# Altium project SmartWatch.PrjPcb
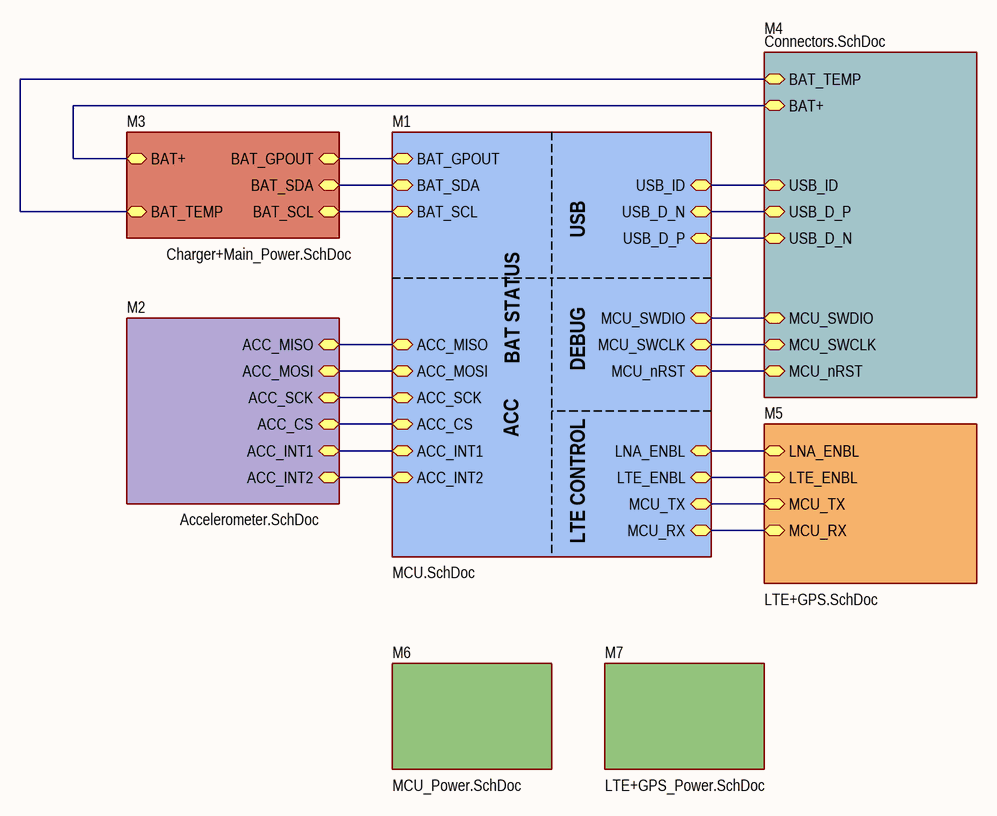
[diagram p0: Top_level.SchDoc]
8 sheets, 111 parts. Net scope: hierarchical (ports join the sheet entries above them; power ports are global).
Sheets:
  Top_level.SchDoc
    M1 = MCU.SchDoc
    M2 = Accelerometer.SchDoc
    M3 = Charger+Main_Power.SchDoc
    M4 = Connectors.SchDoc
    M5 = LTE+GPS.SchDoc
    M6 = MCU_Power.SchDoc
    M7 = LTE+GPS_Power.SchDoc

## Sheet Top_level.SchDoc
size 420 x 297 mm

### Sub-sheets
M1 = MCU.SchDoc: BAT_GPOUT (bidir), BAT_SDA (bidir), BAT_SCL (bidir), ACC_INT2 (bidir), ACC_CS (bidir), LTE_ENBL (bidir), MCU_RX (bidir), ACC_MISO (bidir), ACC_MOSI (bidir), MCU_TX (bidir), MCU_nRST (bidir), MCU_SWCLK (bidir), MCU_SWDIO (bidir), USB_D_N (bidir), USB_D_P (bidir), ACC_INT1 (bidir), ACC_SCK (bidir), USB_ID (bidir), LNA_ENBL (bidir)
M2 = Accelerometer.SchDoc: ACC_MOSI (bidir), ACC_INT1 (bidir), ACC_CS (bidir), ACC_INT2 (bidir), ACC_SCK (bidir), ACC_MISO (bidir)
M3 = Charger+Main_Power.SchDoc: BAT_GPOUT (bidir), BAT_SDA (bidir), BAT_TEMP (bidir), BAT_SCL (bidir), BAT+ (bidir)
M4 = Connectors.SchDoc: BAT_TEMP (bidir), BAT+ (bidir), MCU_SWDIO (bidir), MCU_nRST (bidir), USB_D_P (bidir), USB_ID (bidir), MCU_SWCLK (bidir), USB_D_N (bidir)
M5 = LTE+GPS.SchDoc: LNA_ENBL (bidir), LTE_ENBL (bidir), MCU_RX (bidir), MCU_TX (bidir)
M6 = MCU_Power.SchDoc: no entries
M7 = LTE+GPS_Power.SchDoc: no entries

### Nets
BAT_TS: sheet M3/BAT_TEMP, sheet M4/BAT_TEMP
NetC8_2: sheet M3/BAT+, sheet M4/BAT+
NetC14_2: sheet M1/MCU_nRST, sheet M4/MCU_nRST
NetD3_A1: sheet M1/BAT_GPOUT, sheet M3/BAT_GPOUT
NetD3_A2: sheet M1/BAT_SDA, sheet M3/BAT_SDA
NetD3_A3: sheet M1/BAT_SCL, sheet M3/BAT_SCL
NetD5_1: sheet M1/USB_D_N, sheet M4/USB_D_P
NetD5_3: sheet M1/USB_D_P, sheet M4/USB_D_N
NetD8_C9: sheet M1/MCU_TX, sheet M5/MCU_TX
NetD8_D9: sheet M1/MCU_RX, sheet M5/MCU_RX
NetD8_E3: sheet M1/ACC_INT2, sheet M2/ACC_INT2
NetD8_F3: sheet M1/ACC_SCK, sheet M2/ACC_SCK
NetD8_G2: sheet M1/ACC_INT1, sheet M2/ACC_INT1
NetD8_G3: sheet M1/ACC_MOSI, sheet M2/ACC_MOSI
NetD8_H1: sheet M1/ACC_CS, sheet M2/ACC_CS
NetD8_H2: sheet M1/MCU_SWCLK, sheet M4/MCU_SWCLK
NetD8_H4: sheet M1/LNA_ENBL, sheet M5/LNA_ENBL
NetD8_J1: sheet M1/ACC_MISO, sheet M2/ACC_MISO
NetD8_J2: sheet M1/MCU_SWDIO, sheet M4/MCU_SWDIO
NetD8_J3: sheet M1/USB_ID, sheet M4/USB_ID
NetD8_K2: sheet M1/LTE_ENBL, sheet M5/LTE_ENBL

### Notes on the sheet
- USB
- BAT STATUS
- DEBUG
- ACC
- LTE CONTROL
- Author
- Manufacturer
- Date
- Page
- Total pages
- Size page
- A3
- Materials

## Sheet MCU.SchDoc
size 420 x 297 mm
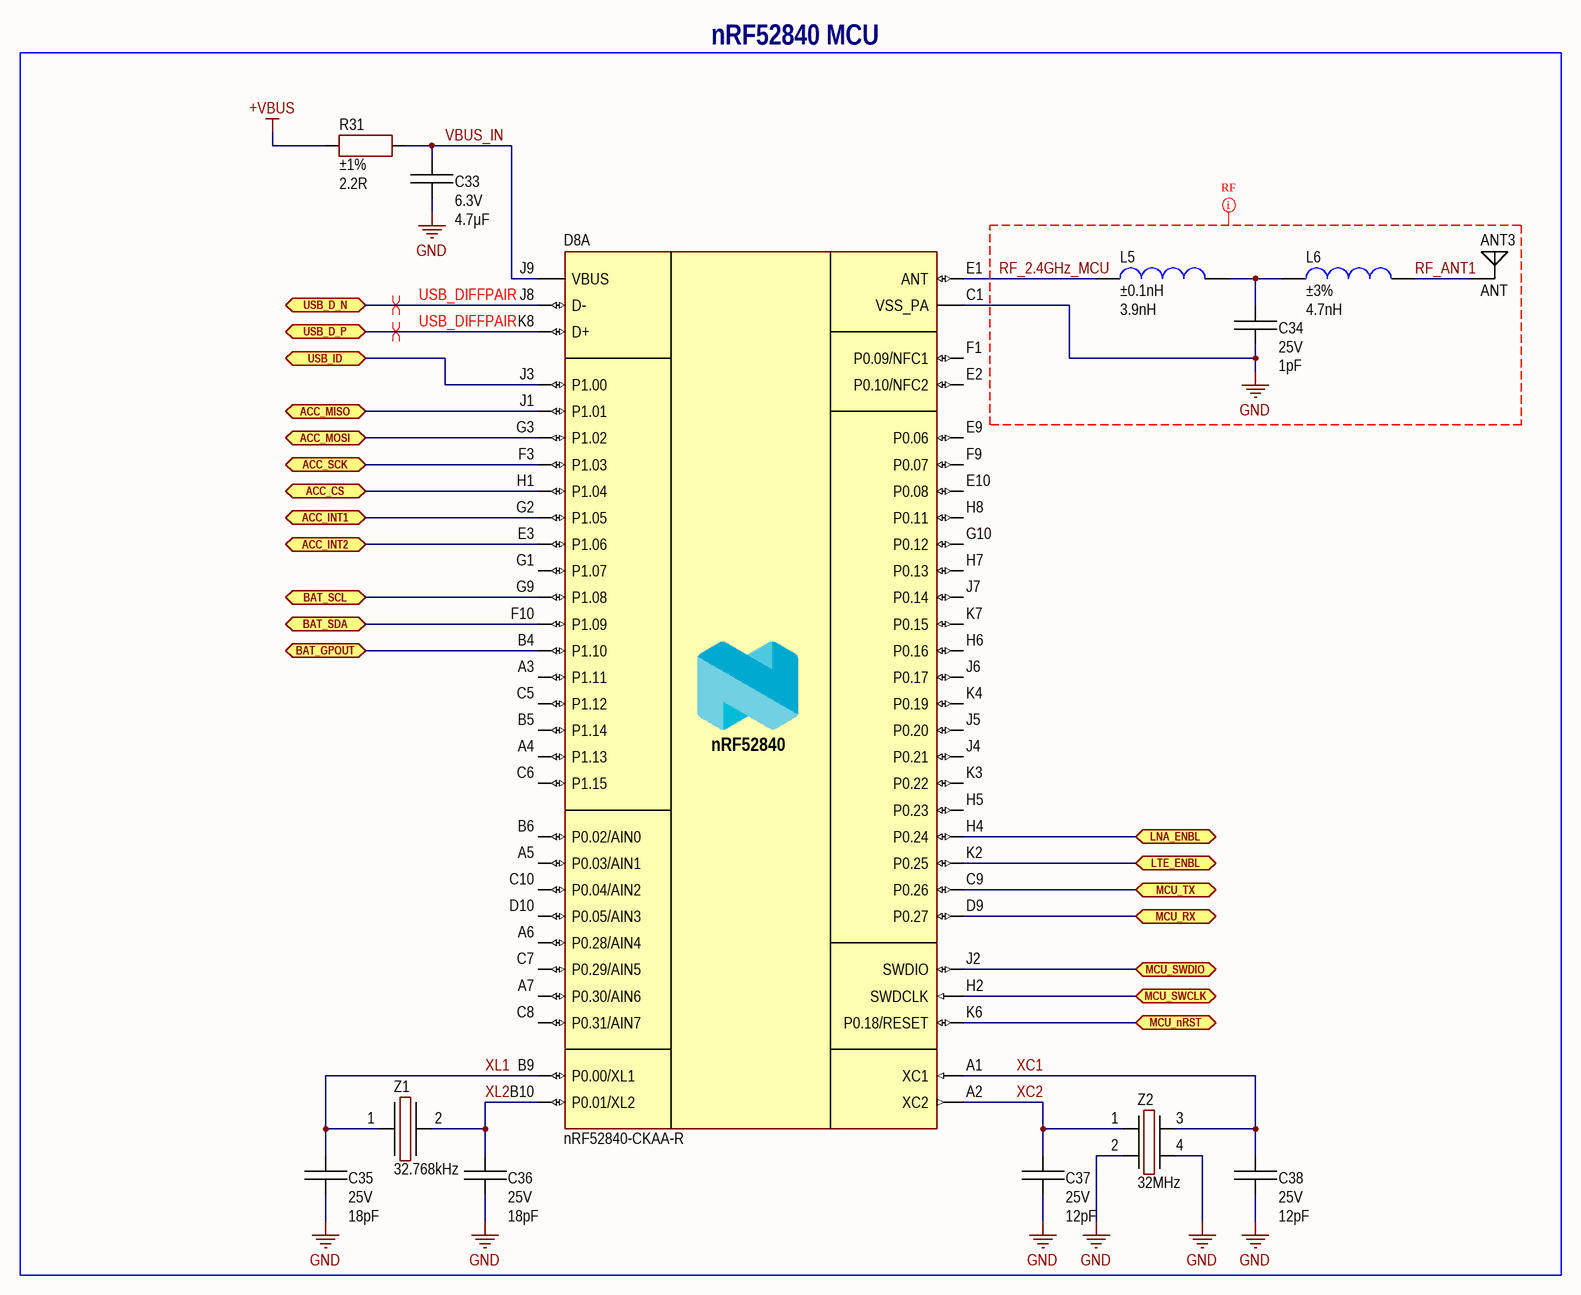
[diagram p1: MCU.SchDoc]

### Parts
ANT3  CommentText: ANT  [ANT: ANT2012LL00R2400A]
C33  value 4.7μF  Voltage: 6.3V  [CAP: 0603_NO_SILK]
C34  value 1pF  Voltage: 25V  [CAP: 0201]
C35  value 18pF  Voltage: 25V  [CAP: 0201]
C36  value 18pF  Voltage: 25V  [CAP: 0201]
C37  value 12pF  Voltage: 25V  [CAP: 0201]
C38  value 12pF  Voltage: 25V  [CAP: 0201]
D8  PartNumber: nRF52840-CKAA-R  [MCU: nRF52840_WLCP93]  (part A of 2)
L5  value 3.9nH  Tolerance: ±0.1nH  [IND: 0201]
L6  value 4.7nH  Tolerance: ±3%  [IND: 0201]
R31  value 2.2R  Tolerance: ±1%  [RES: 0402]
Z1  Frequency: 32.768kHz  [OSC: 2012]
Z2  Frequency: 32MHz  [OSC: 2016]

### Blocks framed on the sheet
nRF52840 MCU: ANT3 C33-C38 D8 L5 L6 R31 Z1 Z2

### Ports
ACC_CS (bidir), ACC_INT1 (bidir), ACC_INT2 (bidir), ACC_MISO (bidir), ACC_MOSI (bidir), ACC_SCK (bidir), BAT_GPOUT (bidir), BAT_SCL (bidir), BAT_SDA (bidir), LNA_ENBL (bidir), LTE_ENBL (bidir), MCU_nRST (bidir), MCU_RX (bidir), MCU_SWCLK (bidir), MCU_SWDIO (bidir), MCU_TX (bidir), USB_D_N (bidir), USB_D_P (bidir), USB_ID (bidir)

### Nets
+VBUS: R31.1
GND: C33.1 C34.1 C35.1 C36.1 C37.1 C38.1 D8.C1(VSS_PA) Z2.2 Z2.4
RF_2.4GHz_MCU: D8.E1(ANT) L5.2
RF_ANT1: ANT3.1 L6.1
VBUS_IN: C33.2 D8.J9(VBUS) R31.2
XC1: C38.2 D8.A1(XC1) Z2.3
XC2: C37.2 D8.A2(XC2) Z2.1
XL1: C35.2 D8.B9(P0.00/XL1) Z1.1
XL2: C36.2 D8.B10(P0.01/XL2) Z1.2
NetC14_2: D8.K6(P0.18/RESET) ; port MCU_nRST
NetC34_2: C34.2 L5.1 L6.2
NetD3_A1: D8.B4(P1.10) ; port BAT_GPOUT
NetD3_A2: D8.F10(P1.09) ; port BAT_SDA
NetD3_A3: D8.G9(P1.08) ; port BAT_SCL
NetD5_1: D8.J8(D-) ; port USB_D_N
NetD5_3: D8.K8(D+) ; port USB_D_P
NetD8_C9: D8.C9(P0.26) ; port MCU_TX
NetD8_D9: D8.D9(P0.27) ; port MCU_RX
NetD8_E3: D8.E3(P1.06) ; port ACC_INT2
NetD8_F3: D8.F3(P1.03) ; port ACC_SCK
NetD8_G2: D8.G2(P1.05) ; port ACC_INT1
NetD8_G3: D8.G3(P1.02) ; port ACC_MOSI
NetD8_H1: D8.H1(P1.04) ; port ACC_CS
NetD8_H2: D8.H2(SWDCLK) ; port MCU_SWCLK
NetD8_H4: D8.H4(P0.24) ; port LNA_ENBL
NetD8_J1: D8.J1(P1.01) ; port ACC_MISO
NetD8_J2: D8.J2(SWDIO) ; port MCU_SWDIO
NetD8_J3: D8.J3(P1.00) ; port USB_ID
NetD8_K2: D8.K2(P0.25) ; port LTE_ENBL

Not connected (* = marked no-connect by the designer): D8 A3(P1.11) A4(P1.13) A5(P0.03/AIN1) A6(P0.28/AIN4) A7(P0.30/AIN6) B5(P1.14) B6(P0.02/AIN0) C5(P1.12) C6(P1.15) C7(P0.29/AIN5) C8(P0.31/AIN7) C10(P0.04/AIN2) D10(P0.05/AIN3) E2(P0.10/NFC2) E9(P0.06) E10(P0.08) F1(P0.09/NFC1) F9(P0.07) G1(P1.07) G10(P0.12) H5(P0.23) H6(P0.16) H7(P0.13) H8(P0.11) J4(P0.21) J5(P0.20) J6(P0.17) J7(P0.14) K3(P0.22) K4(P0.19) K7(P0.15)

### Layout directives
net class RF: GND, RF_2.4GHz_MCU, RF_ANT1
differential pair; differential pair class USB_DIFFPAIR: NetD5_1, NetD5_3

### Notes on the sheet
- Author
- Manufacturer
- Date
- Page
- Total pages
- Size page
- A3
- Materials

### Library data of the parts
ANT3 = ANT2012LL00R2400A: 2.45GHz Bluetooth, ISM, Wi-Fi, Zigbee Chip RF Antenna 2.4GHz ~ 2.5GHz 3.77dBi Solder Surface Mount; Manufacturer: Yageo; ValueManufacturerPartNumber: Ceramic antenna, 2x1.25mm; HelpURL: https://www.digikey.com/en/products/detail/yageo/ANT2012LL00R2400A/9360375; Type: Ceramic antenna; PartNumber: ANT2012LL00R2400A; Package: 2x1.25mm
C33 = Ceramic_0603: 4.7 µF ±20% 6.3V Ceramic Capacitor X7R 0603 (1608 Metric); Manufacturer: Yageo; PartNumber: CC0603MRX7R5BB475; ValueManufacturerPartNumber: Ceramic capacitor, 4.7μF, X7R, ±10%, 6.3V, 0603, -55...+125°C; Tolerance: ±10%; Package: 0603; HelpURL: https://www.digikey.com/en/products/detail/yageo/CC0603MRX7R5BB475/7164380; Temperature: -55...+125°C; TypeCapacitor: Ceramic capacitor; TypeDielectric: X7R
C34 = Ceramic_0201: 1 pF ±0.05pF 25V Ceramic Capacitor C0G, NP0 0201 (0603 Metric); Manufacturer: Murata Electronics; PartNumber: GJM0335C1E1R0WB01D; ValueManufacturerPartNumber: Ceramic capacitor, 1pF, NP0, ±0.05pF, 25V, 0201, -55...+125°C; Package: 0201; HelpURL: https://www.digikey.com/en/products/detail/murata-electronics/GJM0335C1E1R0WB01D/2592505; Temperature: -55...+125°C; TypeCapacitor: Ceramic capacitor; Tolerance: ±0.05pF; TypeDielectric: NP0
C35 C36 = Ceramic_0201: 18 pF ±5% 25V Ceramic Capacitor C0G, NP0 0201 (0603 Metric); Manufacturer: Yageo; PartNumber: CC0201JRNPO8BN180; ValueManufacturerPartNumber: Ceramic capacitor, 18pF, NP0, ±10%, 25V, 0201, -55...+125°C; Tolerance: ±10%; Package: 0201; HelpURL: https://www.digikey.com/en/products/detail/yageo/CC0201JRNPO8BN180/5883131; Temperature: -55...+125°C; TypeCapacitor: Ceramic capacitor; TypeDielectric: NP0
C37 C38 = Ceramic_0201: 12 pF ±5% 25V Ceramic Capacitor C0G, NP0 0201 (0603 Metric); Manufacturer: Yageo; PartNumber: CC0201JRNPO8BN120; ValueManufacturerPartNumber: Ceramic capacitor, 12pF, NP0, ±10%, 25V, 0201, -55...+125°C; Tolerance: ±10%; Package: 0201; HelpURL: https://www.digikey.com/en/products/detail/yageo/CC0201JRNPO8BN120/2833559; Temperature: -55...+125°C; TypeCapacitor: Ceramic capacitor; TypeDielectric: NP0
D8 = nRF52840: MCU; Manufacturer: Nordic Semiconductor; CoreSize: 32bit; Speed: 64 MHz; MemoryROM: 1 MB; CoreProcessor: Cortex-M4; MemoryRAM: 256 kB; HelpURL: https://www.mouser.com/ProductDetail/Nordic-Semiconductor/nRF52840-CKAA-R?qs=PqoDHHvF64%2FDLCQsJ11t5w%3D%3D; ComponentType: IC microcontroller; Package: 93-WLCSP; ValueManufacturerPartNumber: =ComponentType+', '+CoreSize+', '+CoreProcessor+', '+Speed+', '+MemoryROM+', '+MemoryRAM+', '+Supply+', '+Temperature+', '+Package
L5 = Inductor_0201: 3.9 nH Unshielded Thick Film Inductor 400 mA 300mOhm Max 0201 (0603 Metric); Manufacturer: Murata Electronics; PartNumber: LQP03TN3N9B02D; ValueManufacturerPartNumber: Fixed inductor, 3.9nH, ±0.1nH, 0201, 400mA, -55...+125°C; TypeInductor: Fixed inductor; MaxCurrent: 400mA; Package: 0201; HelpURL: https://www.digikey.com/en/products/detail/murata-electronics/LQP03TN3N9B02D/2391748; Temperature: -55...+125°C
L6 = Inductor_0201: 4.7 nH Unshielded Thick Film Inductor 350 mA 400mOhm Max 0201 (0603 Metric); Manufacturer: Murata Electronics; PartNumber: LQP03TN4N7H02D; ValueManufacturerPartNumber: Fixed inductor, 4.7nH, ±3%, 0201, 350mA, -55...+125°C; TypeInductor: Fixed inductor; MaxCurrent: 350mA; Package: 0201; HelpURL: https://www.digikey.com/en/products/detail/murata-electronics/LQP03TN4N7H02D/4358101; Temperature: -55...+125°C
R31 = Resistor_0402: Manufacturer: Yageo; PartNumber: RC0402FR-072R2L; ValueManufacturerPartNumber: Resistor film, 2.2R, ±1%, 0402, 0.063W, -55...+125°C; TypeResistor: Resistor film; Power: 0.063W; Package: 0402; HelpURL: https://www.digikey.com/en/products/detail/yageo/RC0402FR-072R2L/1037048; Temperature: -55...+125°C
Z1 = Crystal_2012: Crystal; Manufacturer: Abracon; PartNumber: ABS06-32.768KHZ-1-T; ValueManufacturerPartNumber: Crystal, 32.768kHz, 12.5pF, ±20ppm, case 2012, -40...+85°C; LoadCapacitance: 12.5pF; Tolerance: ±20ppm; Package: case 2012; HelpURL: https://www.digikey.com/en/products/detail/abracon-llc/ABS06-32-768KHZ-1-T/2217994; Temperature: -40...+85°C; TypeOscilator: Crystal
Z2 = Crystal_2016: 32 MHz ±10ppm Crystal 8pF 60 Ohms 4-SMD, No Lead; Manufacturer: EPSON; PartNumber: FA-128 32.0000MF10Z-AJ3; ValueManufacturerPartNumber: Crystal, 32MHz, 8pF, ±50ppm, case 2016, -30...+85°C; Tolerance: ±50ppm; Package: case 2016; HelpURL: https://www.digikey.com/en/products/detail/epson/FA-128-32-0000MF10Z-AJ3/5259651; Temperature: -30...+85°C; TypeOscilator: Crystal; LoadCapacitance: 8pF

## Sheet Accelerometer.SchDoc
size 420 x 297 mm
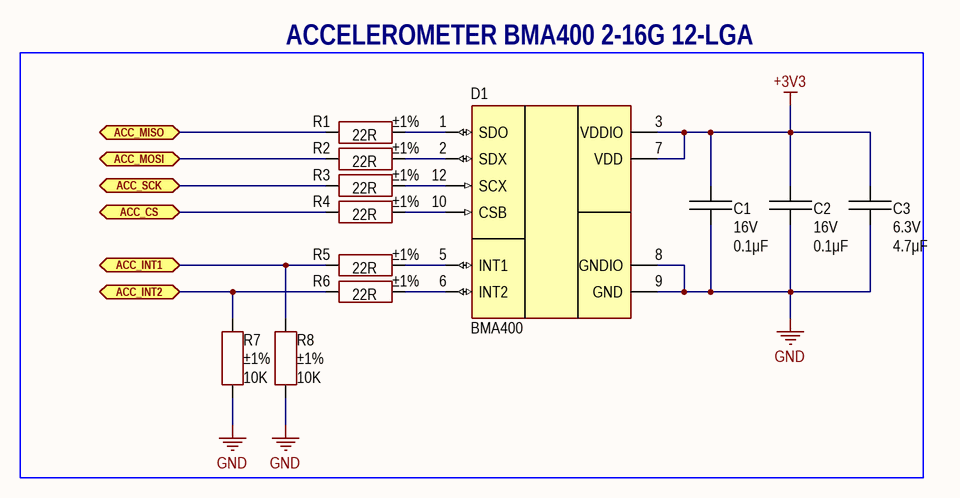
[diagram p2: Accelerometer.SchDoc]

### Parts
C1  value 0.1μF  Voltage: 16V  [CAP: 0402_NO_SILK]
C2  value 0.1μF  Voltage: 16V  [CAP: 0402_NO_SILK]
C3  value 4.7μF  Voltage: 6.3V  [CAP: 0603_NO_SILK]
D1  (no value)  [12-VFLGA]
R1  value 22R  Tolerance: ±1%  [RES: 0201]
R2  value 22R  Tolerance: ±1%  [RES: 0201]
R3  value 22R  Tolerance: ±1%  [RES: 0201]
R4  value 22R  Tolerance: ±1%  [RES: 0201]
R5  value 22R  Tolerance: ±1%  [RES: 0201]
R6  value 22R  Tolerance: ±1%  [RES: 0201]
R7  value 10K  Tolerance: ±1%  [RES: 0201]
R8  value 10K  Tolerance: ±1%  [RES: 0201]

### Blocks framed on the sheet
ACCELEROMETER BMA400 2-16G 12-LGA: C1-C3 D1 R1-R8

### Ports
ACC_CS (bidir), ACC_INT1 (bidir), ACC_INT2 (bidir), ACC_MISO (bidir), ACC_MOSI (bidir), ACC_SCK (bidir)

### Nets
+3V3: C1.2 C2.2 C3.2 D1.3(VDDIO) D1.7(VDD)
GND: C1.1 C2.1 C3.1 D1.8(GNDIO) D1.9(GND) R7.1 R8.1
NetD1_1: D1.1(SDO) R1.1
NetD1_2: D1.2(SDX) R2.1
NetD1_5: D1.5(INT1) R5.1
NetD1_6: D1.6(INT2) R6.1
NetD1_10: D1.10(CSB) R4.1
NetD1_12: D1.12(SCX) R3.1
NetD8_E3: R6.2 R7.2 ; port ACC_INT2
NetD8_F3: R3.2 ; port ACC_SCK
NetD8_G2: R5.2 R8.2 ; port ACC_INT1
NetD8_G3: R2.2 ; port ACC_MOSI
NetD8_H1: R4.2 ; port ACC_CS
NetD8_J1: R1.2 ; port ACC_MISO

### Notes on the sheet
- Author
- Manufacturer
- Date
- Page
- Total pages
- Size page
- A3
- Materials

### Library data of the parts
C1 C2 = Ceramic_0402: 0.1 µF ±10% 16V Ceramic Capacitor X7R 0402 (1005 Metric); Manufacturer: Yageo; PartNumber: CC0402KRX7R7BB104; ValueManufacturerPartNumber: Ceramic capacitor, 0.1μF, X7R, ±10%, 16V, 0402, -55...+125°C; Package: 0402; HelpURL: https://www.digikey.com/product-detail/en/yageo/CC0402KRX7R7BB104/311-1338-1-ND/2103122; Temperature: -55...+125°C; TypeCapacitor: Ceramic capacitor; Tolerance: ±10%; TypeDielectric: X7R
C3 = Ceramic_0603: as C33 on sheet MCU; Package: 0603; HelpURL: https://www.digikey.com/en/products/detail/yageo/CC0603MRX7R5BB475/7164380; Temperature: -55...+125°C; TypeCapacitor: Ceramic capacitor; TypeDielectric: X7R
D1 = BMA400: Accelerometer; Manufacturer: Bosch Sensortec; Supply: 1.72...3.6V; Sensing: Digital sensor; HelpURL: https://www.digikey.com/en/products/detail/bosch-sensortec/BMA400/8634941; Package: 12-VFLGA; ComponentType: IC accelerometer; ValueManufacturerPartNumber: =ComponentType+', '+Sensing+', '+Accuracy+', '+GainBandwidth+', '+Sensitivity+', '+Temperature+', '+Package; Temperature: -40...+85°C; PartNumber: BMA400
R1-R6 = Resistor_0201: 22 Ohms ±1% 0.05W, 1/20W Chip Resistor 0201 (0603 Metric) Moisture Resistant Thick Film; Manufacturer: Yageo; PartNumber: RC0201FR-0722RL; ValueManufacturerPartNumber: Resistor film, 22R, ±1%, 0201, 0.05W, -55...+125°C; TypeResistor: Resistor film; Package: 0201; HelpURL: https://www.digikey.com/en/products/detail/yageo/RC0201FR-0722RL/5280378; Temperature: -55...+125°C; Power: 0.05W
R7 R8 = Resistor_0201: 10 kOhms ±1% 0.05W, 1/20W Chip Resistor 0201 (0603 Metric) Moisture Resistant Thick Film; Manufacturer: Yageo; PartNumber: RC0201JR-0710KL; ValueManufacturerPartNumber: Resistor film, 10K, ±1%, 0201, 0.05W, -55...+125°C; TypeResistor: Resistor film; Package: 0201; HelpURL: https://www.digikey.com/en/products/detail/yageo/RC0201FR-0710KL/1948870; Temperature: -55...+125°C; Power: 0.05W

## Sheet Charger+Main_Power.SchDoc
size 420 x 297 mm
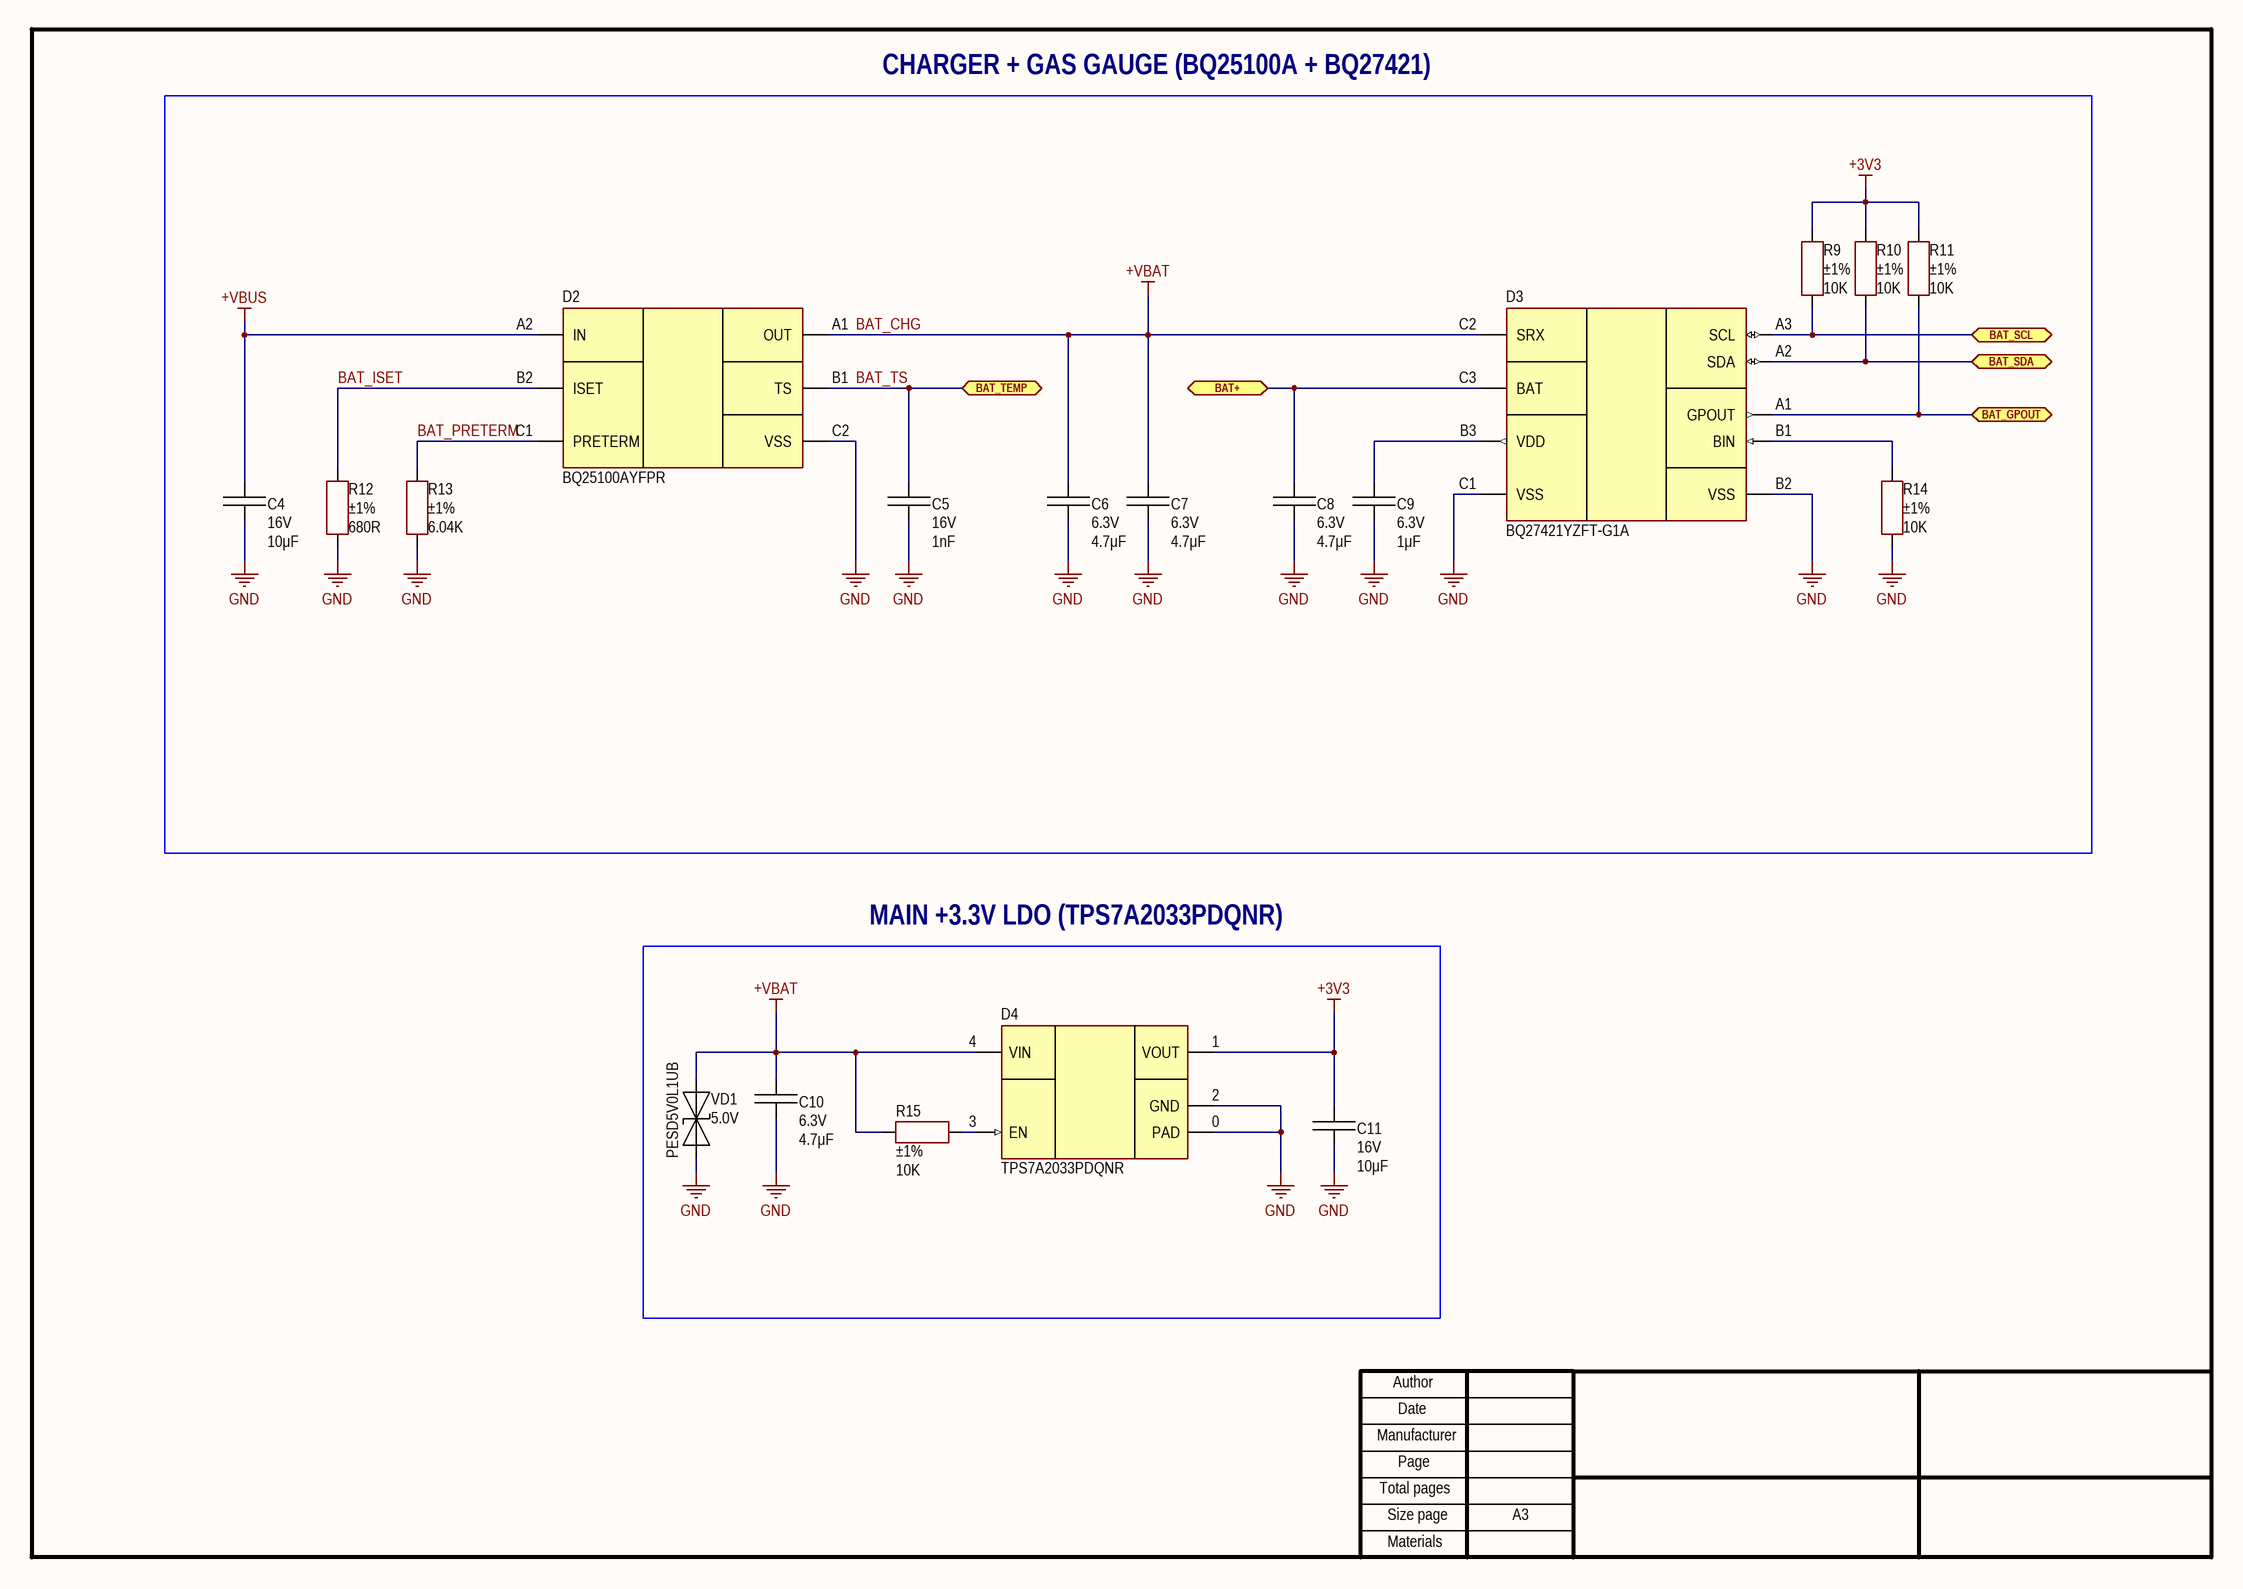
[diagram p3: Charger+Main_Power.SchDoc]

### Parts
C4  value 10μF  Voltage: 16V  [CAP: 0805_NO_SILK]
C5  value 1nF  Voltage: 16V  [CAP: 0201]
C6  value 4.7μF  Voltage: 6.3V  [CAP: 0603_NO_SILK]
C7  value 4.7μF  Voltage: 6.3V  [CAP: 0603_NO_SILK]
C8  value 4.7μF  Voltage: 6.3V  [CAP: 0603_NO_SILK]
C9  value 1μF  Voltage: 6.3V  [CAP: 0402_NO_SILK]
C10  value 4.7μF  Voltage: 6.3V  [CAP: 0603_NO_SILK]
C11  value 10μF  Voltage: 16V  [CAP: 0805_NO_SILK]
D2  (no value)  [IC: BQ25100]
D3  PartNumber: BQ27421YZFT-G1A  [IC: 9-DSBGA]
D4  PartNumber: TPS7A2033PDQNR  [IC: 4-X2SON]
R9  value 10K  Tolerance: ±1%  [RES: 0201]
R10  value 10K  Tolerance: ±1%  [RES: 0201]
R11  value 10K  Tolerance: ±1%  [RES: 0201]
R12  value 680R  Tolerance: ±1%  [RES: 0201]
R13  value 6.04K  Tolerance: ±1%  [RES: 0201]
R14  value 10K  Tolerance: ±1%  [RES: 0201]
R15  value 10K  Tolerance: ±1%  [RES: 0201]
VD1  Voltage: 5.0V  PartNumber: PESD5V0L1UB  [DIODE: SOD523]

### Blocks framed on the sheet
CHARGER + GAS GAUGE (BQ25100A + BQ27421): C4-C9 D2 D3 R9-R14
MAIN +3.3V LDO (TPS7A2033PDQNR): C10 C11 D4 R15 VD1

### Ports
BAT+ (bidir), BAT_GPOUT (bidir), BAT_SCL (bidir), BAT_SDA (bidir), BAT_TEMP (bidir)

### Nets
+3V3: C11.2 D4.1(VOUT) R9.2 R10.2 R11.2
+VBUS: C4.2 D2.A2(IN)
BAT_CHG: C6.2 C7.2 C10.2 D2.A1(OUT) D3.C2(SRX) D4.4(VIN) R15.2 VD1.2(C)  [also labelled +VBAT]
GND: C4.1 C5.1 C6.1 C7.1 C8.1 C9.1 C10.1 C11.1 D2.C2(VSS) D3.B2(VSS) D3.C1(VSS) D4.0(PAD) D4.2(GND) R12.2 R13.1 R14.1 VD1.1(A)
BAT_ISET: D2.B2(ISET) R12.1
BAT_PRETERM: D2.C1(PRETERM) R13.2
BAT_TS: C5.2 D2.B1(TS) ; port BAT_TEMP
NetC8_2: C8.2 D3.C3(BAT) ; port BAT+
NetC9_2: C9.2 D3.B3(VDD)
NetD3_A1: D3.A1(GPOUT) R11.1 ; port BAT_GPOUT
NetD3_A2: D3.A2(SDA) R10.1 ; port BAT_SDA
NetD3_A3: D3.A3(SCL) R9.1 ; port BAT_SCL
NetD3_B1: D3.B1(BIN) R14.2
NetD4_3: D4.3(EN) R15.1

### Notes on the sheet
- Author
- Manufacturer
- Date
- Page
- Total pages
- Size page
- A3
- Materials

### Library data of the parts
C4 C11 = Ceramic_0805: 10 µF ±20% 16V Ceramic Capacitor X7R 0805 (2012 Metric); Manufacturer: Yageo; PartNumber: CC0805MKX7R7BB106; ValueManufacturerPartNumber: Ceramic capacitor, 10μF, X7R, ±10%, 16V, 0805, -55...+125°C; Tolerance: ±10%; Package: 0805; HelpURL: https://www.digikey.com/en/products/detail/yageo/CC0805MKX7R7BB106/7164392; Temperature: -55...+125°C; TypeCapacitor: Ceramic capacitor; TypeDielectric: X7R
C5 = Ceramic_0201: 1000 pF ±10% 16V Ceramic Capacitor X7R 0201 (0603 Metric); Manufacturer: Yageo; PartNumber: CC0201KRX7R7BB102; ValueManufacturerPartNumber: Ceramic capacitor, 1nF, X7R, ±10%, 16V, 0201, -55...+125°C; Package: 0201; HelpURL: https://www.digikey.com/en/products/detail/yageo/CC0201KRX7R7BB102/2833564; Temperature: -55...+125°C; TypeCapacitor: Ceramic capacitor; Tolerance: ±10%; TypeDielectric: X7R
C6-C8 C10 = Ceramic_0603: as C33 on sheet MCU; Package: 0603; HelpURL: https://www.digikey.com/en/products/detail/yageo/CC0603MRX7R5BB475/7164380; Temperature: -55...+125°C; TypeCapacitor: Ceramic capacitor; TypeDielectric: X7R
C9 = Ceramic_0402: 1 µF ±10% 6.3V Ceramic Capacitor X7R 0402 (1005 Metric); Manufacturer: Yageo; PartNumber: CC0402KRX7R5BB105; ValueManufacturerPartNumber: Ceramic capacitor, 1μF, X7R, ±10%, 6.3V, 0402, -55...+125°C; Package: 0402; HelpURL: https://www.digikey.com/en/products/detail/yageo/CC0402KRX7R5BB105/5195111; Temperature: -55...+125°C; TypeCapacitor: Ceramic capacitor; Tolerance: ±10%; TypeDielectric: X7R
D2 = BQ25100AYFPR: PMIC; Manufacturer: Texas Instruments; ValueManufacturerPartNumber: PMIC, Li-Ion/Li-Po, 4.45...6.45V, -40...+85°C, 10-WSON; Supply: 4.45...6.45V; HelpURL: https://www.digikey.com/en/products/detail/texas-instruments/BQ25100AYFPR/4977096; Package: 10-WSON; ComponentType: PMIC; Temperature: -40...+85°C; Standard: Li-Ion/Li-Po; PartNumber: BQ25100AYFPR
D3 = BQ25100AYFPR_1: Gas gauge; Manufacturer: Texas Instruments; ValueManufacturerPartNumber: Gas gauge, Li-Ion, 2.45...4.5V, -40...+85°C, 9-DSBGA; Supply: 2.45...4.5V; HelpURL: https://www.digikey.com/en/products/detail/texas-instruments/BQ27421YZFT-G1A/4212801; Package: 9-DSBGA; ComponentType: Gas gauge; Temperature: -40...+85°C; Standard: Li-Ion
D4 = TPS7A2033: Linear voltage regulator; Manufacturer: Texas Instruments; ValueManufacturerPartNumber: Linear voltage regulator, input 3.44...6V, 2V, 3.3V, 0.3A, -40...+125°C, 4-X2SON; VoltageInput: input 3.44...6V; MaxDropout: 2V; CurrentOutput: 0.3A; VoltageOutput: 3.3V; HelpURL: https://www.digikey.com/en/products/detail/texas-instruments/TPS7A2033PDQNR/13245684; Package: 4-X2SON; ComponentType: Linear voltage regulator; Temperature: -40...+125°C
R9-R11 R14 R15 = Resistor_0201: as R7 on sheet Accelerometer; Package: 0201; HelpURL: https://www.digikey.com/en/products/detail/yageo/RC0201FR-0710KL/1948870; Temperature: -55...+125°C; Power: 0.05W
R12 = Resistor_0201: 680 Ohms ±1% 0.05W, 1/20W Chip Resistor 0201 (0603 Metric) Moisture Resistant Thick Film; Manufacturer: Yageo; PartNumber: RC0201FR-07680RL; ValueManufacturerPartNumber: Resistor film, 680R, ±1%, 0201, 0.05W, -55...+125°C; TypeResistor: Resistor film; Package: 0201; HelpURL: https://www.digikey.com/en/products/detail/yageo/RC0201FR-07680RL/5280629; Temperature: -55...+125°C; Power: 0.05W
R13 = Resistor_0201: 6.04 kOhms ±1% 0.05W, 1/20W Chip Resistor 0201 (0603 Metric) Moisture Resistant Thick Film; Manufacturer: Yageo; PartNumber: RC0201FR-076K04L; ValueManufacturerPartNumber: Resistor film, 6.04K, ±1%, 0201, 0.05W, -55...+125°C; TypeResistor: Resistor film; Package: 0201; HelpURL: https://www.digikey.com/en/products/detail/yageo/RC0201FR-076K04L/5280638; Temperature: -55...+125°C; Power: 0.05W
VD1 = TVS_single: 12V Clamp 3.5A (8/20µs) Ipp Tvs Diode Surface Mount SOD-523; Manufacturer: Nexperia; TypeDiode: ESD TVS diode; Package: SOD-523; HelpURL: https://www.digikey.com/en/products/detail/nexperia-usa-inc/PESD5V0L1UB115/2092297; ValueManufacturerPartNumber: =TypeDiode+', '+Voltage+', '+Current+', '+VoltageDrop+', '+RecoveryTime+', '+Package+', '+Temperature; Temperature: -55...+150°C; Current: 3.5A

## Sheet Connectors.SchDoc
size 420 x 297 mm
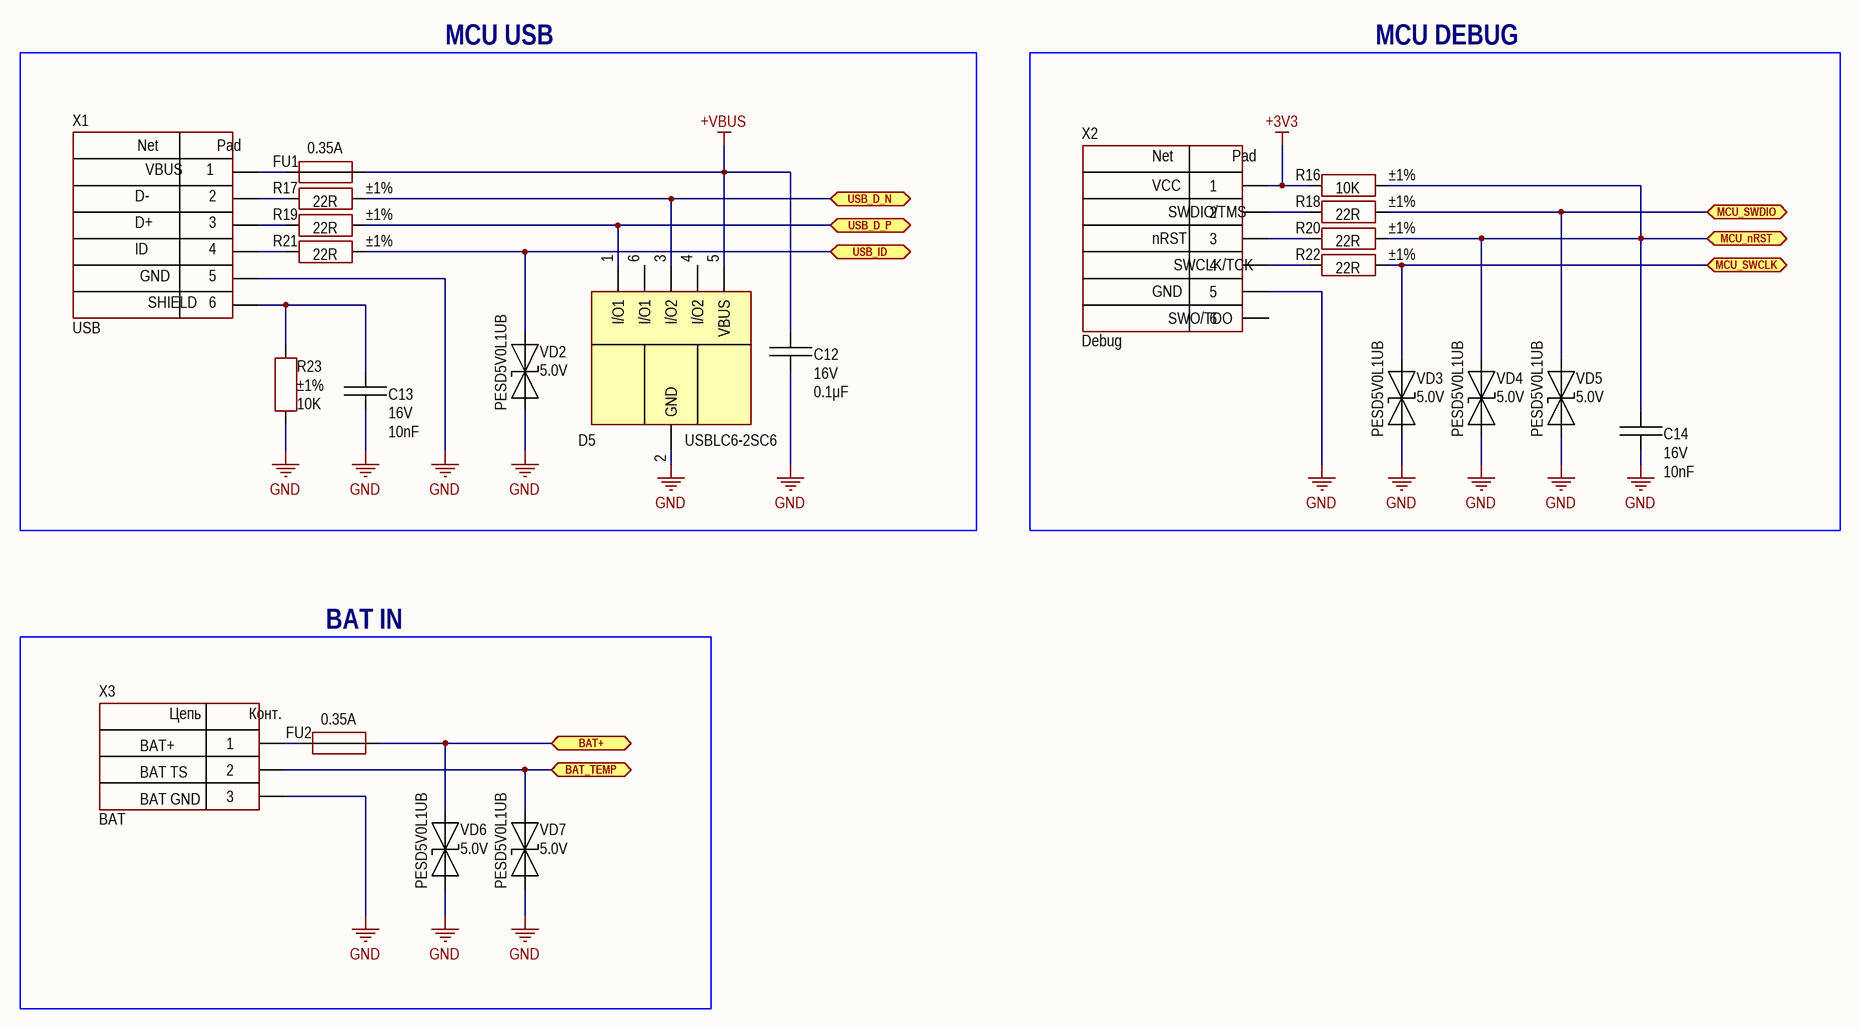
[diagram p4: Connectors.SchDoc]

### Parts
C12  value 0.1μF  Voltage: 16V  [CAP: 0402_NO_SILK]
C13  value 10nF  Voltage: 16V  [CAP: 0201]
C14  value 10nF  Voltage: 16V  [CAP: 0201]
D5  (no value)  [SOT23-6]
FU1  MaxCurrent: 0.35A  [FUSE 0402]
FU2  MaxCurrent: 0.35A  [FUSE 0402]
R16  value 10K  Tolerance: ±1%  [RES: 0201]
R17  value 22R  Tolerance: ±1%  [RES: 0201]
R18  value 22R  Tolerance: ±1%  [RES: 0201]
R19  value 22R  Tolerance: ±1%  [RES: 0201]
R20  value 22R  Tolerance: ±1%  [RES: 0201]
R21  value 22R  Tolerance: ±1%  [RES: 0201]
R22  value 22R  Tolerance: ±1%  [RES: 0201]
R23  value 10K  Tolerance: ±1%  [RES: 0201]
VD2  Voltage: 5.0V  PartNumber: PESD5V0L1UB  [DIODE: SOD523]
VD3  Voltage: 5.0V  PartNumber: PESD5V0L1UB  [DIODE: SOD523]
VD4  Voltage: 5.0V  PartNumber: PESD5V0L1UB  [DIODE: SOD523]
VD5  Voltage: 5.0V  PartNumber: PESD5V0L1UB  [DIODE: SOD523]
VD6  Voltage: 5.0V  PartNumber: PESD5V0L1UB  [DIODE: SOD523]
VD7  Voltage: 5.0V  PartNumber: PESD5V0L1UB  [DIODE: SOD523]
X1  CommentText: USB  [CON: USB micro-A (ZX62-B-5PA)]
X2  CommentText: Debug  [CON: TC2030-IDC-NL]
X3  CommentText: BAT  [CON: WF-03]

### Blocks framed on the sheet
MCU USB: C12 C13 D5 FU1 R17 R19 R21 R23 VD2 X1
MCU DEBUG: C14 R16 R18 R20 R22 VD3-VD5 X2
BAT IN: FU2 VD6 VD7 X3

### Ports
BAT+ (bidir), BAT_TEMP (bidir), MCU_nRST (bidir), MCU_SWCLK (bidir), MCU_SWDIO (bidir), USB_D_N (bidir), USB_D_P (bidir), USB_ID (bidir)

### Nets
+3V3: R16.2 X2.1
+VBUS: C12.2 D5.5(VBUS) FU1.2
GND: C12.1 C13.1 C14.1 D5.2(GND) R23.1 VD2.1(A) VD3.1(A) VD4.1(A) VD5.1(A) VD6.1(A) VD7.1(A) X1.5 X2.5 X3.3
BAT_TS: VD7.2(C) X3.2 ; port BAT_TEMP
NetC8_2: FU2.2 VD6.2(C) ; port BAT+
NetC13_2: C13.2 R23.2 X1.0
NetC14_2: C14.2 R16.1 R20.2 VD4.2(C) ; port MCU_nRST
NetD5_1: D5.1(I/O1) R19.2 ; port USB_D_P
NetD5_3: D5.3(I/O2) R17.2 ; port USB_D_N
NetD8_H2: R22.2 VD3.2(C) ; port MCU_SWCLK
NetD8_J2: R18.2 VD5.2(C) ; port MCU_SWDIO
NetD8_J3: R21.2 VD2.2(C) ; port USB_ID
NetFU1_1: FU1.1 X1.1
NetFU2_1: FU2.1 X3.1
NetR17_1: R17.1 X1.2
NetR18_1: R18.1 X2.2
NetR19_1: R19.1 X1.3
NetR20_1: R20.1 X2.3
NetR21_1: R21.1 X1.4
NetR22_1: R22.1 X2.4

Not connected (* = marked no-connect by the designer): D5 4(I/O2) 6(I/O1); X2 6

### Notes on the sheet
- BAT+
- BAT TS
- BAT GND
- Author
- Manufacturer
- Date
- Page
- Total pages
- Size page
- A3
- Materials
- (in symbol Connector_USB_micro_B) Net; Pad; VBUS; D-; D+; ID; GND; SHIELD; 6
- (in symbol TC2030-IDC-NL) Net; Pad; VCC; SWDIO/TMS; nRST; SWCLK/TCK; GND; SWO/TDO
- (in symbol WF-3) Цепь; Конт.

### Library data of the parts
C12 = Ceramic_0402: as C1 on sheet Accelerometer; Package: 0402; HelpURL: https://www.digikey.com/product-detail/en/yageo/CC0402KRX7R7BB104/311-1338-1-ND/2103122; Temperature: -55...+125°C; TypeCapacitor: Ceramic capacitor; Tolerance: ±10%; TypeDielectric: X7R
C13 C14 = Ceramic_0201: 10000 pF ±10% 16V Ceramic Capacitor X7R 0201 (0603 Metric); Manufacturer: Yageo; PartNumber: CC0201KRX7R7BB103; ValueManufacturerPartNumber: Ceramic capacitor, 10nF, X7R, ±10%, 16V, 0201, -55...+125°C; Package: 0201; HelpURL: https://www.digikey.com/en/products/detail/yageo/CC0201KRX7R7BB103/2833569; Temperature: -55...+125°C; TypeCapacitor: Ceramic capacitor; Tolerance: ±10%; TypeDielectric: X7R
D5 = USBLC6-2SC6: ESD diode array; Manufacturer: STMicroelectronics; TypeDiode: USB protection; Current: 5A peak; VoltageDrop: 17V; RecoveryTime: Power line; Package: SOT-23-6; HelpURL: https://www.digikey.com/product-detail/en/stmicroelectronics/USBLC6-2SC6/497-5235-1-ND/1121688; ValueManufacturerPartNumber: =TypeDiode+', '+Voltage+', '+Current+', '+VoltageDrop+', '+RecoveryTime+', '+Package+', '+Temperature; Temperature: -40...+125°C; PartNumber: USBLC6-2SC6
FU1 FU2 = Fuse: Polymeric PTC Resettable Fuse 6V 350 mA Ih Surface Mount 0402 (1005 Metric), Concave; Manufacturer: Bourns; PartNumber: MF-ASML035/6-2; VoltageMax: 250VAC; Package: 0402; HelpURL: https://www.digikey.com/en/products/detail/bourns-inc/MF-ASML035-6-2/10268609; ValueManufacturerPartNumber: =TypeFuse+', '+VoltageMax+', '+MaxCurrent+', '+Package+', '+Temperature; TypeFuse: PTC
R16 R23 = Resistor_0201: as R7 on sheet Accelerometer; Package: 0201; HelpURL: https://www.digikey.com/en/products/detail/yageo/RC0201FR-0710KL/1948870; Temperature: -55...+125°C; Power: 0.05W
R17-R22 = Resistor_0201: as R1 on sheet Accelerometer; Package: 0201; HelpURL: https://www.digikey.com/en/products/detail/yageo/RC0201FR-0722RL/5280378; Temperature: -55...+125°C; Power: 0.05W
VD2-VD7 = TVS_single: as VD1 on sheet Charger+Main_Power; Package: SOD-523; HelpURL: https://www.digikey.com/en/products/detail/nexperia-usa-inc/PESD5V0L1UB115/2092297; ValueManufacturerPartNumber: =TypeDiode+', '+Voltage+', '+Current+', '+VoltageDrop+', '+RecoveryTime+', '+Package+', '+Temperature; Temperature: -55...+150°C; Current: 3.5A
X1 = Connector_USB_micro_B: USB-micro; Manufacturer: Hirose Electric; ValueManufacturerPartNumber: USB micro B; PartNumber: ZX62-B-5PA; HelpURL: https://www.digikey.com/product-detail/en/hirose-electric-co-ltd/ZX62-B-5PA/H11579CT-ND/1851090; TypeConnector: USB micro B
X2 = TC2030-IDC-NL: Tag-connect TC2030-IDC-NL debug footprint; TypeConnector: Debug connector; Multichannel: 6pin; Manufacturer: Tag-Connect; HelpURL: http://www.klsele.com/products/Terminal-blocks/560/278.html; ValueManufacturerPartNumber: =TypeConnector+', '+Multichannel+', '+Pitch+', '+VoltageMax+', '+CurrentMax; PartNumber: TC2030-IDC-NL
X3 = WF-3: Manufacturer: Connfly; ValueManufacturerPartNumber: Connector, 3pin, 2.54mm, 250VAC, 3A; TypeConnector: Connector; VoltageMax: 250VAC; Pitch: 2.54mm; CurrentMax: 3A; Multichannel: 3pin; HelpURL: https://www.chipdip.ru/product/wf-3; PartNumber: WF-3

## Sheet LTE+GPS.SchDoc
size 420 x 297 mm
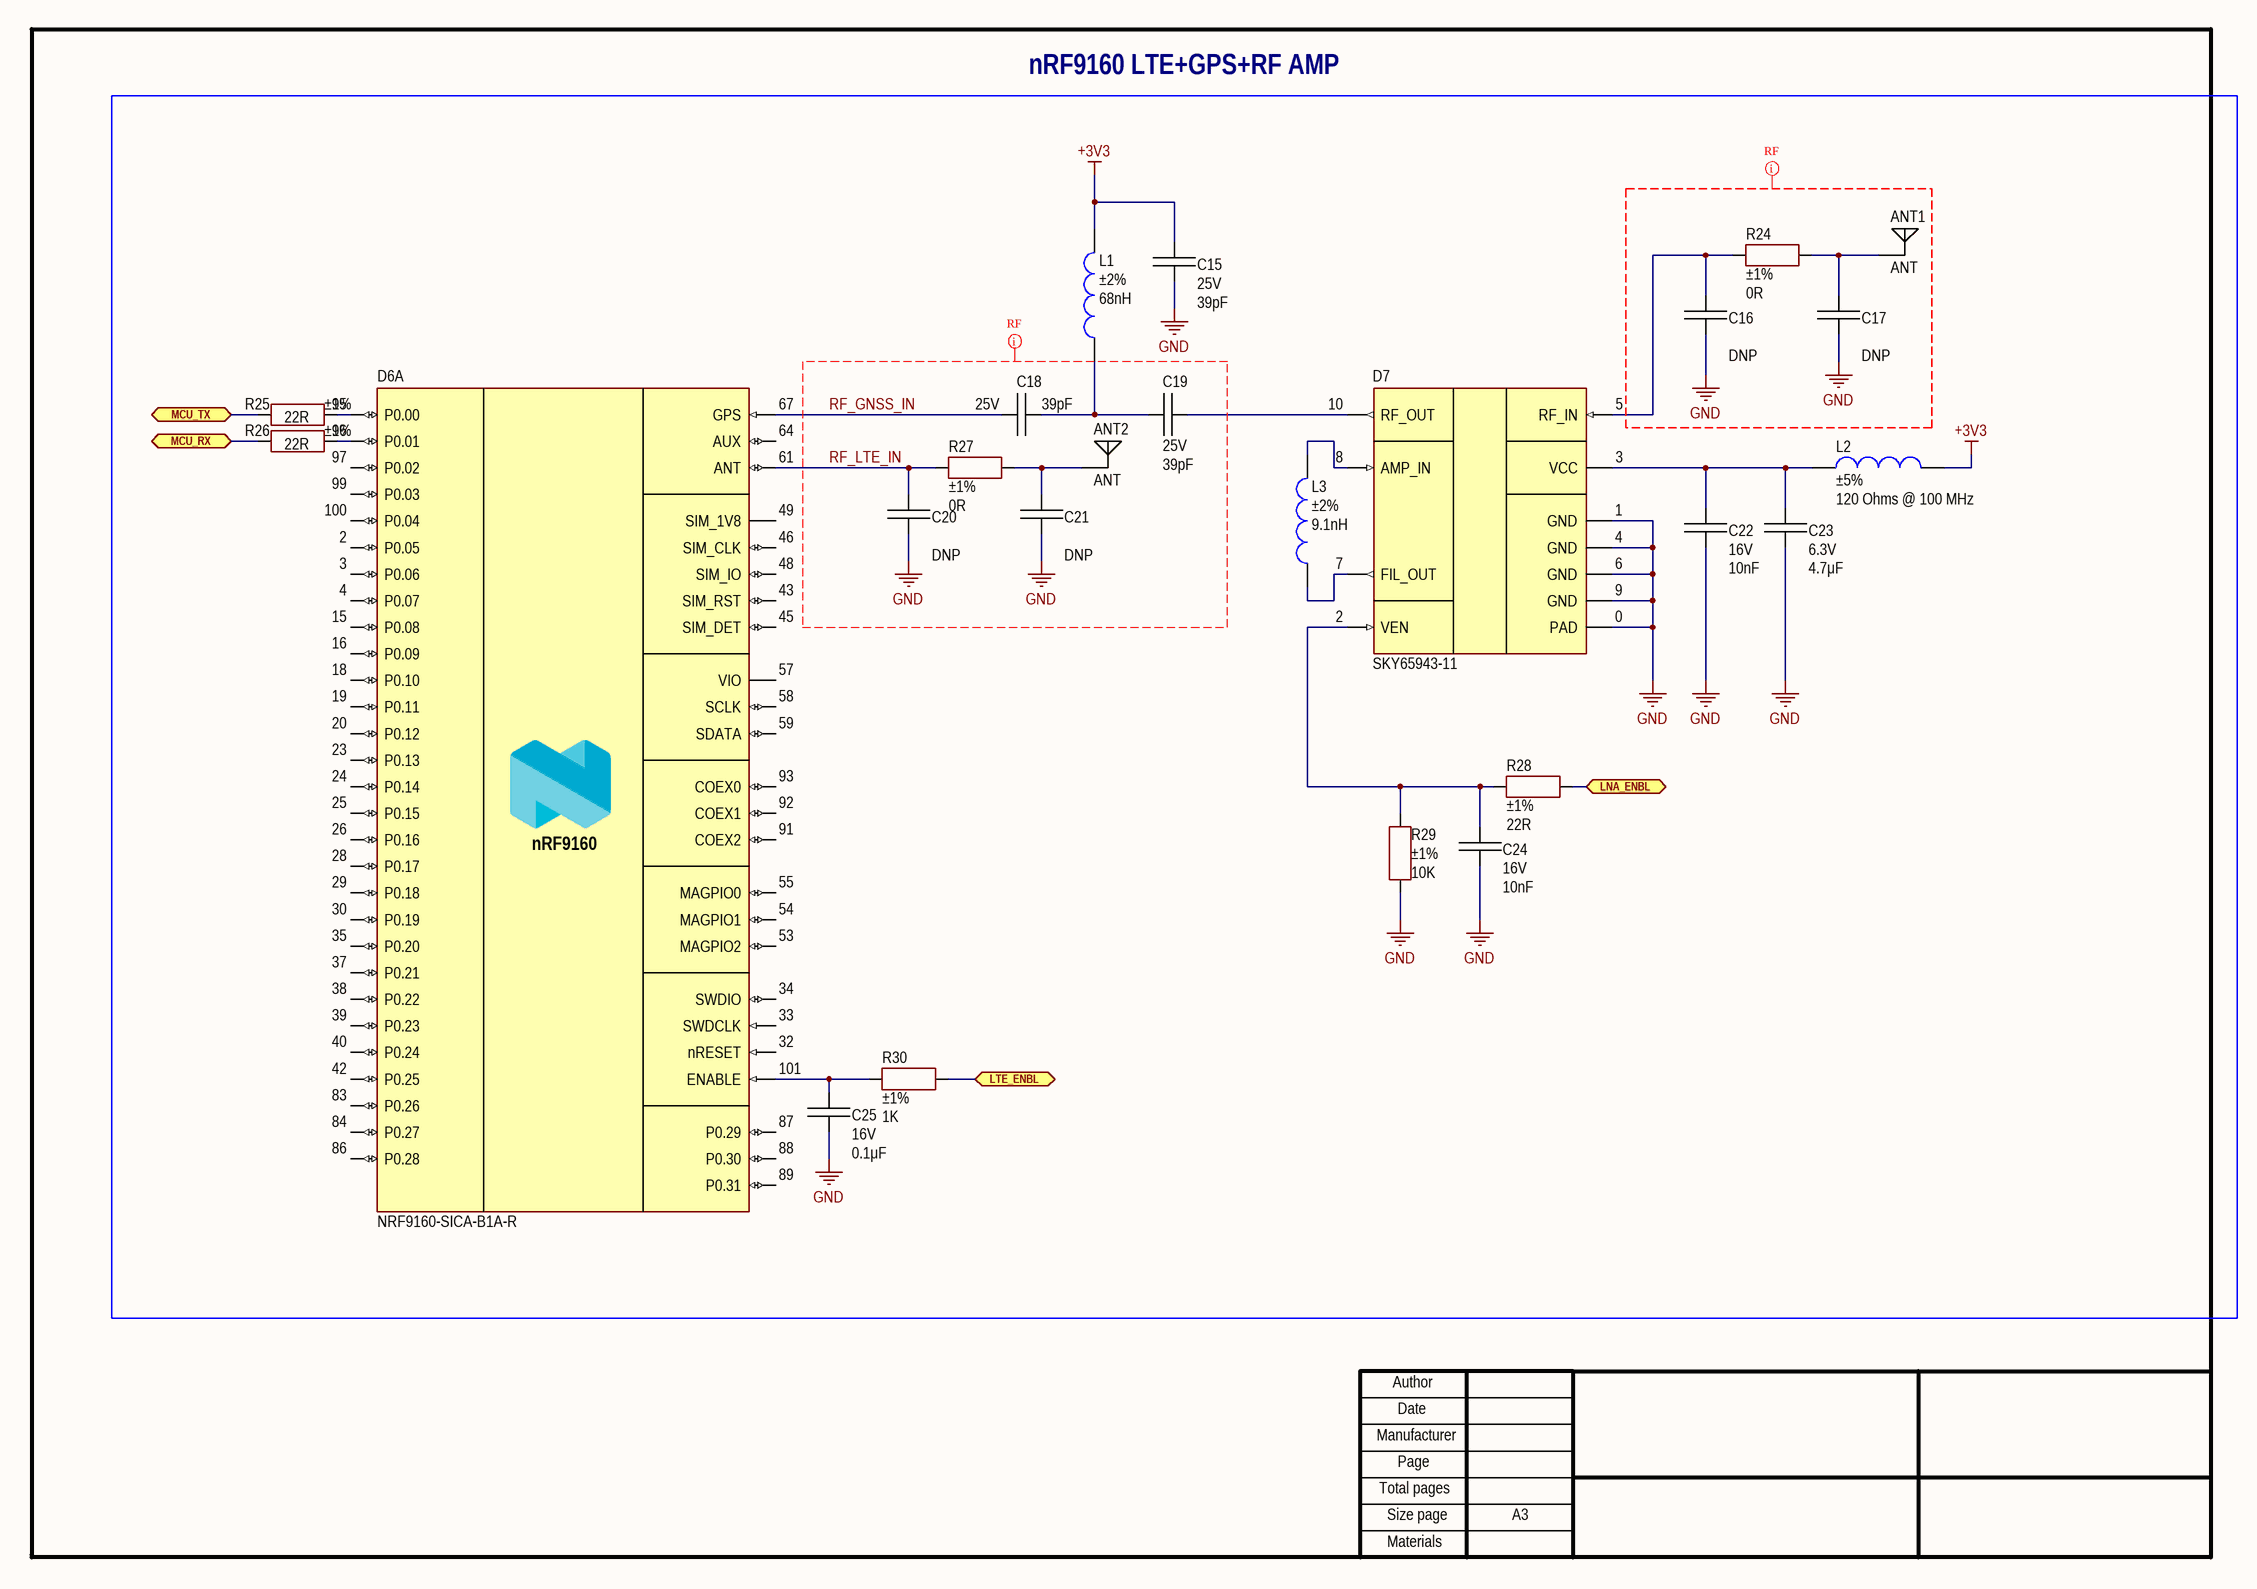
[diagram p5: LTE+GPS.SchDoc]

### Parts
ANT1  CommentText: ANT  [ANT: ANT2012LL00R2400A]
ANT2  CommentText: ANT  [ANT: ANT2012LL00R2400A]
C15  value 39pF  Voltage: 25V  [CAP: 0201]
C16  value DNP  [CAP: 0201]
C17  value DNP  [CAP: 0201]
C18  value 39pF  Voltage: 25V  [CAP: 0201]
C19  value 39pF  Voltage: 25V  [CAP: 0201]
C20  value DNP  [CAP: 0201]
C21  value DNP  [CAP: 0201]
C22  value 10nF  Voltage: 16V  [CAP: 0201]
C23  value 4.7μF  Voltage: 6.3V  [CAP: 0603_NO_SILK]
C24  value 10nF  Voltage: 16V  [CAP: 0201]
C25  value 0.1μF  Voltage: 16V  [CAP: 0402_NO_SILK]
D6  PartNumber: NRF9160-SICA-B1A-R  [MOD: NRF9160]  (part A of 3)
D7  (no value)  [IC: SKY65943-11]
L1  value 68nH  Tolerance: ±2%  [IND: 0402]
L2  value 120 Ohms @ 100 MHz  Tolerance: ±5%  [IND: 0402]
L3  value 9.1nH  Tolerance: ±2%  [IND: 0402]
R24  value 0R  Tolerance: ±1%  [RES: 0201]
R25  value 22R  Tolerance: ±1%  [RES: 0201]
R26  value 22R  Tolerance: ±1%  [RES: 0201]
R27  value 0R  Tolerance: ±1%  [RES: 0201]
R28  value 22R  Tolerance: ±1%  [RES: 0201]
R29  value 10K  Tolerance: ±1%  [RES: 0201]
R30  value 1K  Tolerance: ±1%  [RES: 0201]

### Blocks framed on the sheet
nRF9160 LTE+GPS+RF AMP: ANT1 ANT2 C15-C25 D6 D7 L1-L3 R24-R30

### Ports
LNA_ENBL (bidir), LTE_ENBL (bidir), MCU_RX (bidir), MCU_TX (bidir)

### Nets
+3V3: C15.1 L1.1 L2.1
GND: C15.2 C16.1 C17.1 C20.1 C21.1 C22.1 C23.1 C24.1 C25.1 D7.0(PAD) D7.1(GND) D7.4(GND) D7.6(GND) D7.9(GND) R29.1
RF_GNSS_IN: C18.2 D6.67(GPS)
RF_LTE_IN: C20.2 D6.61(ANT) R27.2
NetANT1_1: ANT1.1 C17.2 R24.1
NetANT2_1: ANT2.1 C21.2 R27.1
NetC16_2: C16.2 D7.5(RF_IN) R24.2
NetC18_1: C18.1 C19.2 L1.2
NetC19_1: C19.1 D7.10(RF_OUT)
NetC22_2: C22.2 C23.2 D7.3(VCC) L2.2
NetC24_2: C24.2 D7.2(VEN) R28.1 R29.2
NetC25_2: C25.2 D6.101(ENABLE) R30.2
NetD6_95: D6.95(P0.00) R25.1
NetD6_96: D6.96(P0.01) R26.1
NetD7_7: D7.7(FIL_OUT) L3.2
NetD7_8: D7.8(AMP_IN) L3.1
NetD8_C9: R25.2 ; port MCU_TX
NetD8_D9: R26.2 ; port MCU_RX
NetD8_H4: R28.2 ; port LNA_ENBL
NetD8_K2: R30.1 ; port LTE_ENBL

Not connected (* = marked no-connect by the designer): D6 2(P0.05) 3(P0.06) 4(P0.07) 15(P0.08) 16(P0.09) 18(P0.10) 19(P0.11) 20(P0.12) 23(P0.13) 24(P0.14) 25(P0.15) 26(P0.16) 28(P0.17) 29(P0.18) 30(P0.19) 32(nRESET) 33(SWDCLK) 34(SWDIO) 35(P0.20) 37(P0.21) 38(P0.22) 39(P0.23) 40(P0.24) 42(P0.25) 43(SIM_RST) 45(SIM_DET) 46(SIM_CLK) 48(SIM_IO) 49(SIM_1V8) 53(MAGPIO2) 54(MAGPIO1) 55(MAGPIO0) 57(VIO) 58(SCLK) 59(SDATA) 64(AUX) 83(P0.26) 84(P0.27) 86(P0.28) 87(P0.29) 88(P0.30) 89(P0.31) 91(COEX2) 92(COEX1) 93(COEX0) 97(P0.02) 99(P0.03) 100(P0.04)

### Layout directives
net class RF: GND, RF_GNSS_IN, RF_LTE_IN

### Notes on the sheet
- Author
- Manufacturer
- Date
- Page
- Total pages
- Size page
- A3
- Materials

### Library data of the parts
ANT1 ANT2 = ANT2012LL00R2400A: as ANT3 on sheet MCU; HelpURL: https://www.digikey.com/en/products/detail/yageo/ANT2012LL00R2400A/9360375; Type: Ceramic antenna; PartNumber: ANT2012LL00R2400A; Package: 2x1.25mm
C15 C18 C19 = Ceramic_0201: 39 pF ±5% 25V Ceramic Capacitor C0G, NP0 0201 (0603 Metric); Manufacturer: Murata Electronics; PartNumber: GRM0335C1E390JA01D; ValueManufacturerPartNumber: Ceramic capacitor, 39pF, NP0, ±5%, 25V, 0201, -55...+125°C; Package: 0201; HelpURL: https://www.digikey.com/en/products/detail/murata-electronics/GRM0335C1E390JA01D/4358216; Temperature: -55...+125°C; TypeCapacitor: Ceramic capacitor; Tolerance: ±5%; TypeDielectric: NP0
C16 C17 C20 C21 = Ceramic_0201: DNP; ValueManufacturerPartNumber: Ceramic capacitor, DNP, , , , 0201, -55...+125°C; TypeCapacitor: Ceramic capacitor; Package: 0201; Temperature: -55...+125°C
C22 C24 = Ceramic_0201: as C13 on sheet Connectors; Package: 0201; HelpURL: https://www.digikey.com/en/products/detail/yageo/CC0201KRX7R7BB103/2833569; Temperature: -55...+125°C; TypeCapacitor: Ceramic capacitor; Tolerance: ±10%; TypeDielectric: X7R
C23 = Ceramic_0603: as C33 on sheet MCU; Package: 0603; HelpURL: https://www.digikey.com/en/products/detail/yageo/CC0603MRX7R5BB475/7164380; Temperature: -55...+125°C; TypeCapacitor: Ceramic capacitor; TypeDielectric: X7R
C25 = Ceramic_0402: as C1 on sheet Accelerometer; Package: 0402; HelpURL: https://www.digikey.com/product-detail/en/yageo/CC0402KRX7R7BB104/311-1338-1-ND/2103122; Temperature: -55...+125°C; TypeCapacitor: Ceramic capacitor; Tolerance: ±10%; TypeDielectric: X7R
D6 = nRF9160: LTE/GSM module; Manufacturer: Nordic Semiconductor; Supply: 3...5.5V; Frequency: 2.4GHz; TypeProtocol: LTE-M/NB-IoT/GPS; HelpURL: https://www.digikey.com/en/products/detail/nordic-semiconductor-asa/NRF9160-SICA-B1A-R/13533595; Package: 127-LGA; ComponentType: LTE/GSM module; ValueManufacturerPartNumber: =ComponentType+', '+TypeProtocol+', '+Frequency+', '+CoreSize+', '+CoreProcessor+', '+MemoryROM+', '+MemoryRAM+', '+Supply+', '+Temperature+', '+Package; Temperature: -40...+85°C
D7 = SKY65943-11: RF front-end; Manufacturer: Skyworks Solutions; ValueManufacturerPartNumber: IC RF amplifier, 2.7 GHz, 19dB, -40...+125°C, 10-SMD Module; Gain: 19dB; Frequency: 2.7 GHz; HelpURL: https://www.digikey.com/en/products/detail/skyworks-solutions-inc/SKY65943-11/9603434; Package: 10-SMD Module; ComponentType: IC RF amplifier; Temperature: -40...+125°C; PartNumber: SKY65943-11
L1 = Inductor_0402: 68 nH Unshielded Wirewound Inductor 320 mA 1.1Ohm Max 0402 (1005 Metric); Manufacturer: Murata Electronics; PartNumber: LQW15AN68NG80D; ValueManufacturerPartNumber: Fixed inductor, 68nH, ±2%, 0402, 0.32A, -55...+125°C; TypeInductor: Fixed inductor; MaxCurrent: 0.32A; Package: 0402; HelpURL: https://www.digikey.com/en/products/detail/murata-electronics/LQW15AN68NG80D/4864887; Temperature: -55...+125°C
L2 = Inductor_0402: 120 Ohms @ 100 MHz 1 Power Line Ferrite Bead 0402 (1005 Metric) 2A 55mOhm; Manufacturer: Murata Electronics; PartNumber: BLM15PX121SN1D; ValueManufacturerPartNumber: Fixed inductor, 120 Ohms @ 100 MHz, ±5%, 0402, 2A, -55...+125°C; TypeInductor: Fixed inductor; Package: 0402; HelpURL: https://www.digikey.com/en/products/detail/murata-electronics/BLM15PX121SN1D/4421095; Temperature: -55...+125°C; MaxCurrent: 2A
L3 = Inductor_0402: 9.1 nH Unshielded Wirewound Inductor 1.4 A 80mOhm Max 0402 (1005 Metric); Manufacturer: Murata Electronics; PartNumber: LQW15AN9N1G8ZD; ValueManufacturerPartNumber: Fixed inductor, 9.1nH, ±2%, 0402, 1.4A, -55...+125°C; TypeInductor: Fixed inductor; MaxCurrent: 1.4A; Package: 0402; HelpURL: https://www.digikey.com/en/products/detail/murata-electronics/LQW15AN9N1G8ZD/6799034; Temperature: -55...+125°C
R24 R27 = Resistor_0201: 0 Ohms Jumper 0.05W, 1/20W Chip Resistor 0201 (0603 Metric) Moisture Resistant Thick Film; Manufacturer: Yageo; PartNumber: RC0201FR-070RL; ValueManufacturerPartNumber: Resistor film, 0R, ±1%, 0201, 0.05W, -55...+125°C; TypeResistor: Resistor film; Package: 0201; HelpURL: https://www.digikey.com/en/products/detail/yageo/RC0201FR-070RL/1948858; Temperature: -55...+125°C; Power: 0.05W
R25 R26 R28 = Resistor_0201: as R1 on sheet Accelerometer; Package: 0201; HelpURL: https://www.digikey.com/en/products/detail/yageo/RC0201FR-0722RL/5280378; Temperature: -55...+125°C; Power: 0.05W
R29 = Resistor_0201: as R7 on sheet Accelerometer; Package: 0201; HelpURL: https://www.digikey.com/en/products/detail/yageo/RC0201FR-0710KL/1948870; Temperature: -55...+125°C; Power: 0.05W
R30 = Resistor_0201: 1 kOhms ±1% 0.05W, 1/20W Chip Resistor 0201 (0603 Metric) Moisture Resistant Thick Film; Manufacturer: Yageo; PartNumber: RC0201JR-071KL; ValueManufacturerPartNumber: Resistor film, 1K, ±1%, 0201, 0.05W, -55...+125°C; TypeResistor: Resistor film; Package: 0201; HelpURL: https://www.digikey.com/en/products/detail/yageo/RC0201FR-071KL/3202389; Temperature: -55...+125°C; Power: 0.05W

## Sheet MCU_Power.SchDoc
size 420 x 297 mm
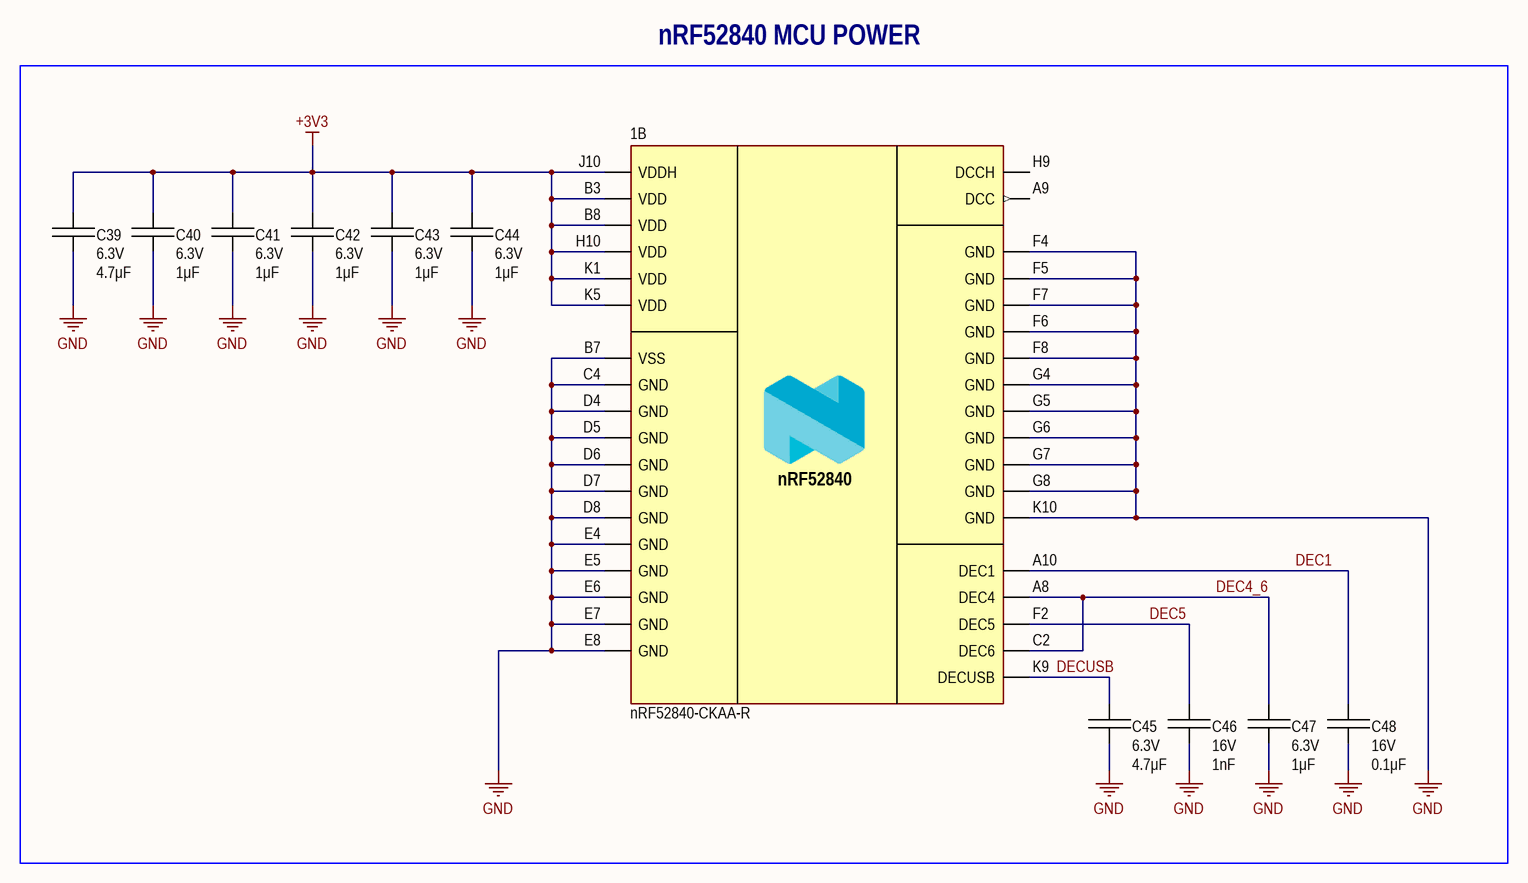
[diagram p6: MCU_Power.SchDoc]

### Parts
1  PartNumber: nRF52840-CKAA-R  [MCU: nRF52840_WLCP93]  (part B of 2)
C39  value 4.7μF  Voltage: 6.3V  [CAP: 0603_NO_SILK]
C40  value 1μF  Voltage: 6.3V  [CAP: 0402_NO_SILK]
C41  value 1μF  Voltage: 6.3V  [CAP: 0402_NO_SILK]
C42  value 1μF  Voltage: 6.3V  [CAP: 0402_NO_SILK]
C43  value 1μF  Voltage: 6.3V  [CAP: 0402_NO_SILK]
C44  value 1μF  Voltage: 6.3V  [CAP: 0402_NO_SILK]
C45  value 4.7μF  Voltage: 6.3V  [CAP: 0603_NO_SILK]
C46  value 1nF  Voltage: 16V  [CAP: 0201]
C47  value 1μF  Voltage: 6.3V  [CAP: 0402_NO_SILK]
C48  value 0.1μF  Voltage: 16V  [CAP: 0402_NO_SILK]

### Blocks framed on the sheet
nRF52840 MCU POWER: 1 C39-C48

### Nets
+3V3: 1.B3(VDD) 1.B8(VDD) 1.H10(VDD) 1.J10(VDDH) 1.K1(VDD) 1.K5(VDD) C39.2 C40.2 C41.2 C42.2 C43.2 C44.2
GND: 1.B7(VSS) 1.C4(GND) 1.D4(GND) 1.D5(GND) 1.D6(GND) 1.D7(GND) 1.D8(GND) 1.E4(GND) 1.E5(GND) 1.E6(GND) 1.E7(GND) 1.E8(GND) 1.F4(GND) 1.F5(GND) 1.F6(GND) 1.F7(GND) 1.F8(GND) 1.G4(GND) 1.G5(GND) 1.G6(GND) 1.G7(GND) 1.G8(GND) 1.K10(GND) C39.1 C40.1 C41.1 C42.1 C43.1 C44.1 C45.1 C46.1 C47.1 C48.1
DEC1: 1.A10(DEC1) C48.2
DEC4_6: 1.A8(DEC4) 1.C2(DEC6) C47.2
DEC5: 1.F2(DEC5) C46.2
DECUSB: 1.K9(DECUSB) C45.2

Not connected (* = marked no-connect by the designer): 1 A9(DCC) H9(DCCH)

### Notes on the sheet
- Author
- Manufacturer
- Date
- Page
- Total pages
- Size page
- A3
- Materials

### Library data of the parts
1 = nRF52840: as D8 on sheet MCU; HelpURL: https://www.mouser.com/ProductDetail/Nordic-Semiconductor/nRF52840-CKAA-R?qs=PqoDHHvF64%2FDLCQsJ11t5w%3D%3D; ComponentType: IC microcontroller; Package: 93-WLCSP; ValueManufacturerPartNumber: =ComponentType+', '+CoreSize+', '+CoreProcessor+', '+Speed+', '+MemoryROM+', '+MemoryRAM+', '+Supply+', '+Temperature+', '+Package
C39 C45 = Ceramic_0603: as C33 on sheet MCU; Package: 0603; HelpURL: https://www.digikey.com/en/products/detail/yageo/CC0603MRX7R5BB475/7164380; Temperature: -55...+125°C; TypeCapacitor: Ceramic capacitor; TypeDielectric: X7R
C40-C44 C47 = Ceramic_0402: as C9 on sheet Charger+Main_Power; Package: 0402; HelpURL: https://www.digikey.com/en/products/detail/yageo/CC0402KRX7R5BB105/5195111; Temperature: -55...+125°C; TypeCapacitor: Ceramic capacitor; Tolerance: ±10%; TypeDielectric: X7R
C46 = Ceramic_0201: as C5 on sheet Charger+Main_Power; Package: 0201; HelpURL: https://www.digikey.com/en/products/detail/yageo/CC0201KRX7R7BB102/2833564; Temperature: -55...+125°C; TypeCapacitor: Ceramic capacitor; Tolerance: ±10%; TypeDielectric: X7R
C48 = Ceramic_0402: as C1 on sheet Accelerometer; Package: 0402; HelpURL: https://www.digikey.com/product-detail/en/yageo/CC0402KRX7R7BB104/311-1338-1-ND/2103122; Temperature: -55...+125°C; TypeCapacitor: Ceramic capacitor; Tolerance: ±10%; TypeDielectric: X7R

## Sheet LTE+GPS_Power.SchDoc
size 420 x 297 mm
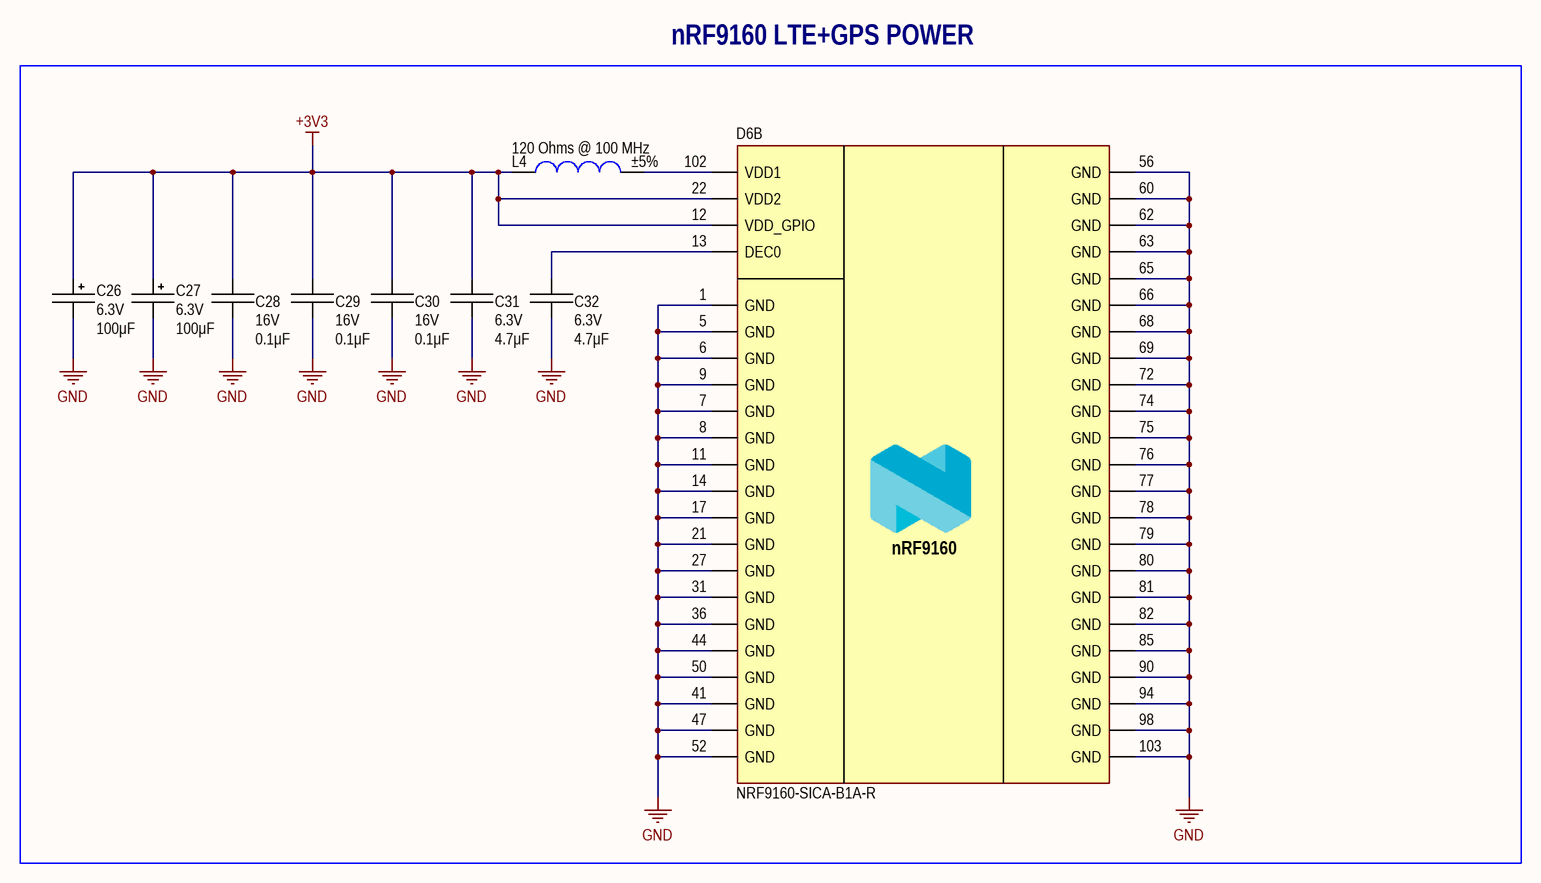
[diagram p7: LTE+GPS_Power.SchDoc]

### Parts
C26  value 100μF  Voltage: 6.3V  [CAP: TANTAL-A]
C27  value 100μF  Voltage: 6.3V  [CAP: TANTAL-A]
C28  value 0.1μF  Voltage: 16V  [CAP: 0402_NO_SILK]
C29  value 0.1μF  Voltage: 16V  [CAP: 0402_NO_SILK]
C30  value 0.1μF  Voltage: 16V  [CAP: 0402_NO_SILK]
C31  value 4.7μF  Voltage: 6.3V  [CAP: 0603_NO_SILK]
C32  value 4.7μF  Voltage: 6.3V  [CAP: 0603_NO_SILK]
D6  PartNumber: NRF9160-SICA-B1A-R  [MOD: NRF9160]  (part B of 3)
L4  value 120 Ohms @ 100 MHz  Tolerance: ±5%  [IND: 0402]

### Blocks framed on the sheet
nRF9160 LTE+GPS POWER: C26-C32 D6 L4

### Nets
+3V3: C26.1 C27.1 C28.2 C29.2 C30.2 C31.2 D6.12(VDD_GPIO) D6.22(VDD2) L4.2
GND: C26.2 C27.2 C28.1 C29.1 C30.1 C31.1 C32.1 D6.1(GND) D6.5(GND) D6.6(GND) D6.7(GND) D6.8(GND) D6.9(GND) D6.11(GND) D6.14(GND) D6.17(GND) D6.21(GND) D6.27(GND) D6.31(GND) D6.36(GND) D6.41(GND) D6.44(GND) D6.47(GND) D6.50(GND) D6.52(GND) D6.56(GND) D6.60(GND) D6.62(GND) D6.63(GND) D6.65(GND) D6.66(GND) D6.68(GND) D6.69(GND) D6.72(GND) D6.74(GND) D6.75(GND) D6.76(GND) D6.77(GND) D6.78(GND) D6.79(GND) D6.80(GND) D6.81(GND) D6.82(GND) D6.85(GND) D6.90(GND) D6.94(GND) D6.98(GND) D6.103(GND)
NetC32_2: C32.2 D6.13(DEC0)
NetD6_102: D6.102(VDD1) L4.1

### Notes on the sheet
- Author
- Manufacturer
- Date
- Page
- Total pages
- Size page
- A3
- Materials

### Library data of the parts
C26 C27 = Tantal_A: 100 µF Molded Tantalum Polymer Capacitor 6.3 V 1206 (3216 Metric) 100mOhm @ 100kHz; Manufacturer: AVX; PartNumber: TCJA107M006R0100; ValueManufacturerPartNumber: Tantalum capacitor, 100μF, 6.3V, ±10%, 100 mOhm, case A (3216), -55...+125°C; Tolerance: ±10%; TypeDielectric: X7R; TypeCapacitor: Tantalum capacitor; Package: case A (3216); HelpURL: https://www.digikey.com/en/products/detail/avx-corporation/TCJA107M006R0100/4990371; Temperature: -55...+125°C; Impedance: 100 mOhm
C28-C30 = Ceramic_0402: as C1 on sheet Accelerometer; Package: 0402; HelpURL: https://www.digikey.com/product-detail/en/yageo/CC0402KRX7R7BB104/311-1338-1-ND/2103122; Temperature: -55...+125°C; TypeCapacitor: Ceramic capacitor; Tolerance: ±10%; TypeDielectric: X7R
C31 C32 = Ceramic_0603: as C33 on sheet MCU; Package: 0603; HelpURL: https://www.digikey.com/en/products/detail/yageo/CC0603MRX7R5BB475/7164380; Temperature: -55...+125°C; TypeCapacitor: Ceramic capacitor; TypeDielectric: X7R
D6 = nRF9160: as D6 on sheet LTE+GPS; HelpURL: https://www.digikey.com/en/products/detail/nordic-semiconductor-asa/NRF9160-SICA-B1A-R/13533595; Package: 127-LGA; ComponentType: LTE/GSM module; ValueManufacturerPartNumber: =ComponentType+', '+TypeProtocol+', '+Frequency+', '+CoreSize+', '+CoreProcessor+', '+MemoryROM+', '+MemoryRAM+', '+Supply+', '+Temperature+', '+Package; Temperature: -40...+85°C
L4 = Inductor_0402: as L2 on sheet LTE+GPS; Package: 0402; HelpURL: https://www.digikey.com/en/products/detail/murata-electronics/BLM15PX121SN1D/4421095; Temperature: -55...+125°C; MaxCurrent: 2A

## Nets that join several sheets
+3V3: Accelerometer (5 pins), Charger+Main_Power (5 pins), Connectors (R16.2 X2.1), LTE+GPS (C15.1 L1.1 L2.1), MCU_Power (12 pins), LTE+GPS_Power (9 pins)
+VBUS: MCU (R31.1), Charger+Main_Power (C4.2 D2.A2), Connectors (C12.2 D5.5 FU1.2)
GND: MCU (9 pins), Accelerometer (7 pins), Charger+Main_Power (17 pins), Connectors (14 pins), LTE+GPS (15 pins), MCU_Power (33 pins), LTE+GPS_Power (48 pins)
BAT_TS: Charger+Main_Power (C5.2 D2.B1), Connectors (VD7.2 X3.2)
NetC8_2: Charger+Main_Power (C8.2 D3.C3), Connectors (FU2.2 VD6.2)
NetC14_2: MCU (D8.K6), Connectors (C14.2 R16.1 R20.2 VD4.2)
NetD3_A1: MCU (D8.B4), Charger+Main_Power (D3.A1 R11.1)
NetD3_A2: MCU (D8.F10), Charger+Main_Power (D3.A2 R10.1)
NetD3_A3: MCU (D8.G9), Charger+Main_Power (D3.A3 R9.1)
NetD5_1: MCU (D8.J8), Connectors (D5.1 R19.2)
NetD5_3: MCU (D8.K8), Connectors (D5.3 R17.2)
NetD8_C9: MCU (D8.C9), LTE+GPS (R25.2)
NetD8_D9: MCU (D8.D9), LTE+GPS (R26.2)
NetD8_E3: MCU (D8.E3), Accelerometer (R6.2 R7.2)
NetD8_F3: MCU (D8.F3), Accelerometer (R3.2)
NetD8_G2: MCU (D8.G2), Accelerometer (R5.2 R8.2)
NetD8_G3: MCU (D8.G3), Accelerometer (R2.2)
NetD8_H1: MCU (D8.H1), Accelerometer (R4.2)
NetD8_H2: MCU (D8.H2), Connectors (R22.2 VD3.2)
NetD8_H4: MCU (D8.H4), LTE+GPS (R28.2)
NetD8_J1: MCU (D8.J1), Accelerometer (R1.2)
NetD8_J2: MCU (D8.J2), Connectors (R18.2 VD5.2)
NetD8_J3: MCU (D8.J3), Connectors (R21.2 VD2.2)
NetD8_K2: MCU (D8.K2), LTE+GPS (R30.1)